# EAGLE design mds2 (EAGLE 7.3.0)
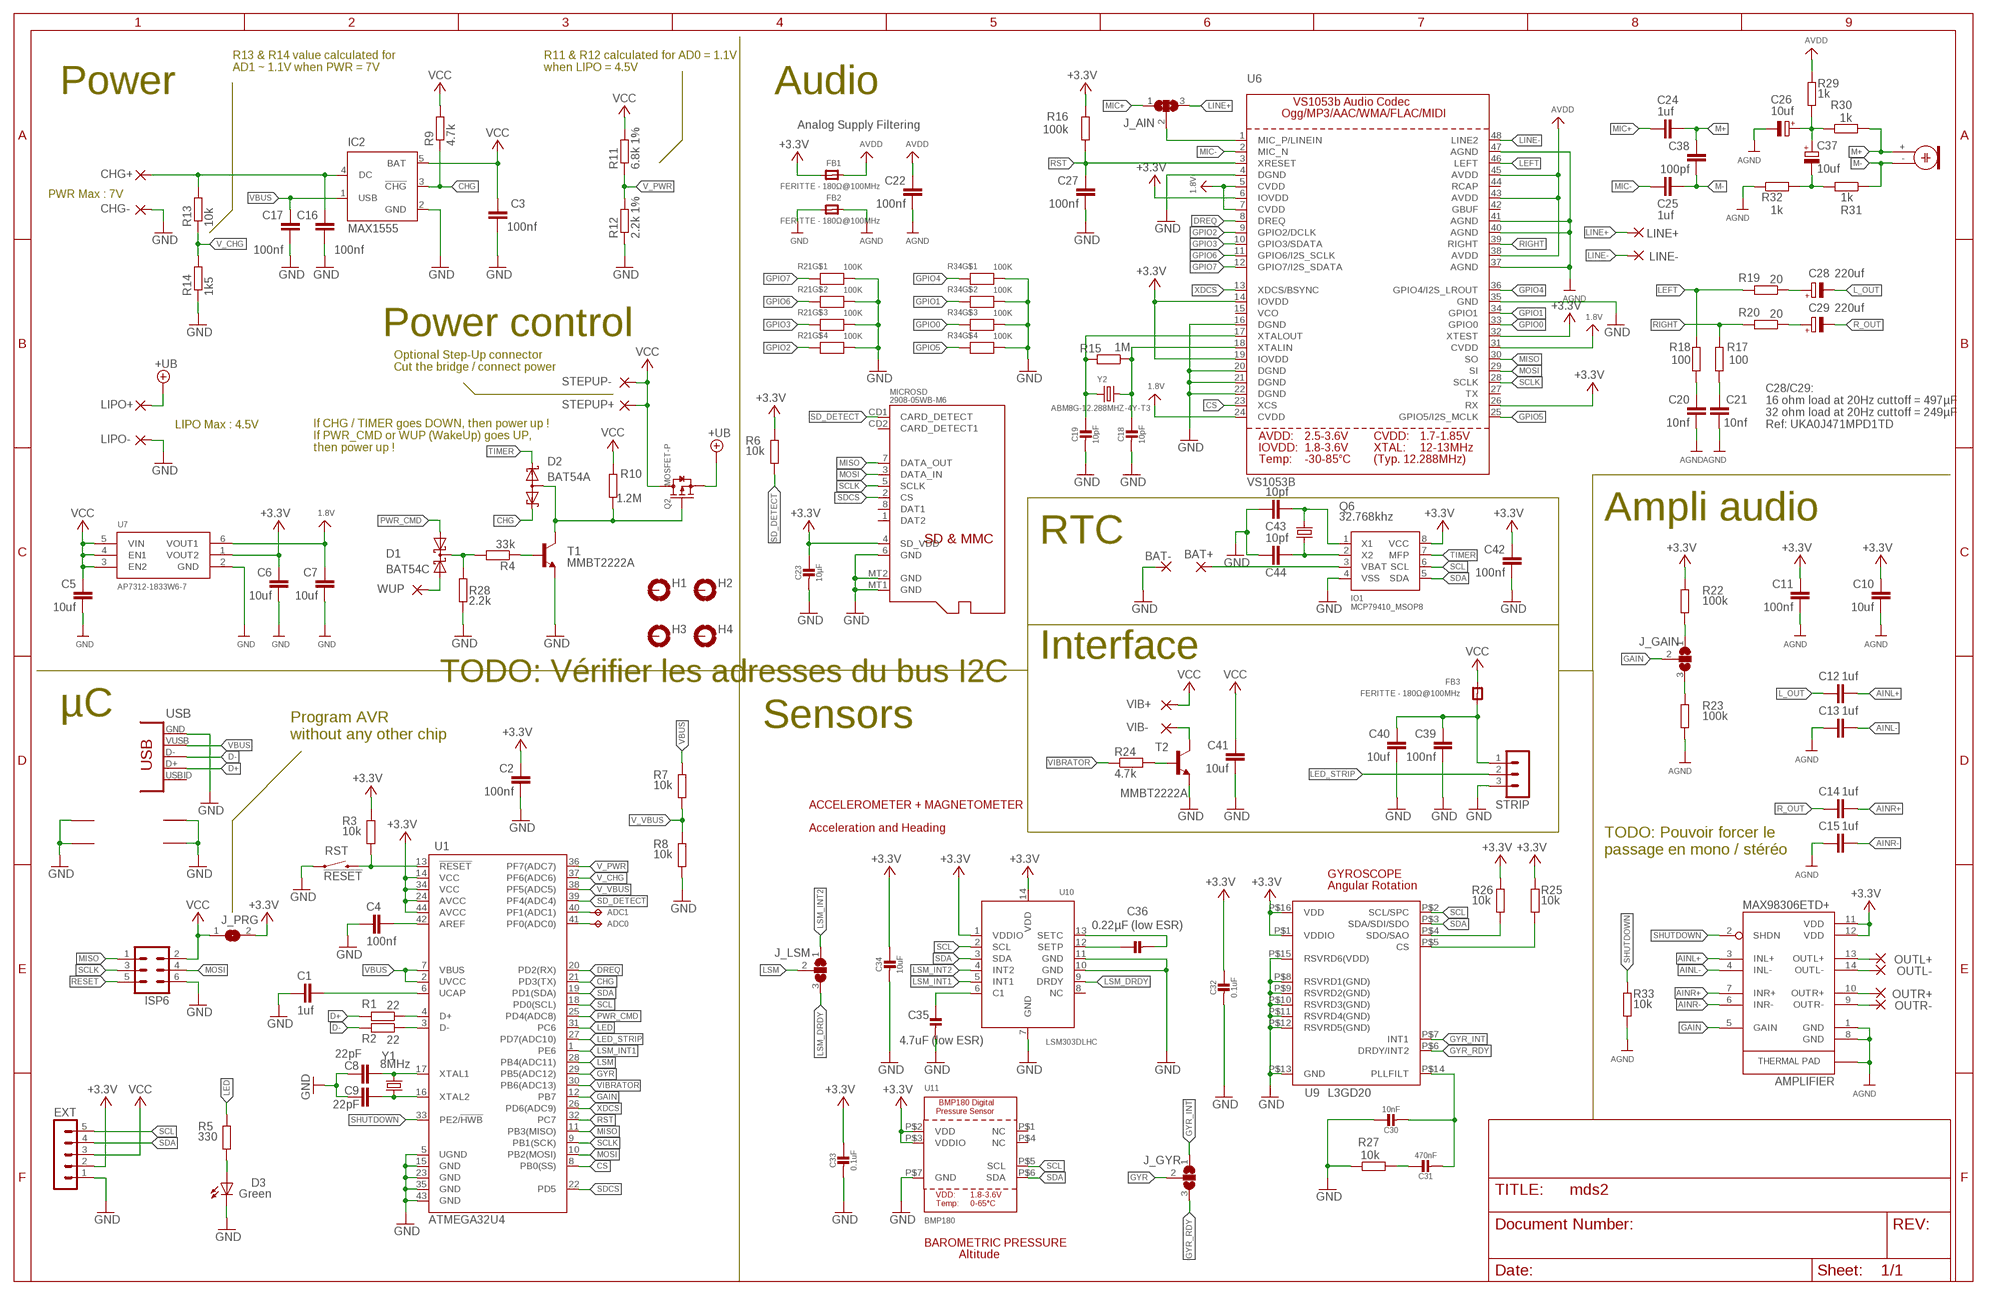
[diagram p0: schematic, sheet 1]

## Parts
ADC0  TPB1,27  [B1,27]
ADC1  TPB1,27  [B1,27]
AMPLIFIER  MAX98306ETD+  [14-TDFN]
BAT+  1,6/0,8  [1,6/0,8]
BAT-  1,6/0,8  [1,6/0,8]
C1  1uf  C-EUC0805  [C0805]
C2  100nf  C-EUC0805  [C0805]
C3  100nf  C-EUC0805  [C0805]
C4  100nf  C-EUC0805  [C0805]
C5  10uf  C-EUC0805  [C0805]
C6  10uf  C-EUC0805  [C0805]
C7  10uf  C-EUC0805  [C0805]
C8  22pF  CAP0402-CAP  [0402-CAP]
C9  22pF  CAP0402-CAP  [0402-CAP]
C10  10uf  C-EUC0805  [C0805]
C11  100nf  C-EUC0805  [C0805]
C12  1uf  C-EUC0805  [C0805]
C13  1uf  C-EUC0805  [C0805]
C14  1uf  C-EUC0805  [C0805]
C15  1uf  C-EUC0805  [C0805]
C16  100nf  C-EUC0805  [C0805]
C17  100nf  C-EUC0805  [C0805]
C18  10pF  CAP_CERAMIC_0805MP  [_0805MP]
C19  10pF  CAP_CERAMIC_0805MP  [_0805MP]
C20  10nf  C-EUC0805  [C0805]
C21  10nf  C-EUC0805  [C0805]
C22  100nf  C-EUC0805  [C0805]
C23  10µF  CAP_CERAMIC_0805MP  [_0805MP]
C24  1uf  C-EUC0805  [C0805]
C25  1uf  C-EUC0805  [C0805]
C26  10uf  CPOL-EUC  [PANASONIC_C]
C27  100nf  C-EUC0805  [C0805]
C28  220uf  CPOL-EUD  [PANASONIC_D]
C29  220uf  CPOL-EUD  [PANASONIC_D]
C30  10nF  CAP_CERAMIC_0805MP  [_0805MP]
C31  470nF  CAP_CERAMIC_0805MP  [_0805MP]
C32  0.1uF  CAP_CERAMIC_0805MP  [_0805MP]
C33  0.1uF  CAP_CERAMIC_0805MP  [_0805MP]
C34  10uF  CAP_CERAMIC_0805MP  [_0805MP]
C35  4.7uF (low ESR)  CAP_CERAMIC_0805MP  [_0805MP]
C36  0.22µF (low ESR)  CAP_CERAMIC_0805MP  [_0805MP]
C37  10uf  CPOL-EUC  [PANASONIC_C]
C38  100pf  C-EUC0805  [C0805]
C39  100nf  C-EUC0805  [C0805]
C40  10uf  C-EUC0805  [C0805]
C41  10uf  C-EUC0805  [C0805]
C42  100nf  C-EUC0805  [C0805]
C43  10pf  C-EUC0805  [C0805]
C44  10pf  C-EUC0805  [C0805]
CHG+  2,15/1,0  [2,15/1,0]
CHG-  2,15/1,0  [2,15/1,0]
D1  BAT54C  [SOT23]
D2  BAT54A  [SOT23]
D3  Green  LED0603  [LED-0603]
EXT  MA05-1  [MA05-1]
FB1  FERITTE - 180Ω@100MHz  FERRITE_0805MP  [_0805MP]
FB2  FERITTE - 180Ω@100MHz  FERRITE_0805MP  [_0805MP]
FB3  FERITTE - 180Ω@100MHz  FERRITE_0805MP  [_0805MP]
H1  MOUNT-PAD-ROUND3.0  [3,0-PAD]
H2  MOUNT-PAD-ROUND3.0  [3,0-PAD]
H3  MOUNT-PAD-ROUND3.0  [3,0-PAD]
H4  MOUNT-PAD-ROUND3.0  [3,0-PAD]
IC2  MAX1555  [SOT23-5L]
IO1  MCP79410_MSOP8  [MSOP8]
ISP6  MA03-2  [MA03-2]
J_AIN  SJ2W  [SJ_2]
J_GAIN  SJ2W  [SJ_2]
J_GYR  SJ2W  [SJ_2]
J_LSM  SJ2W  [SJ_2]
J_PRG  SJ  [SJ]
LINE+  1,6/0,8  [1,6/0,8]
LINE-  1,6/0,8  [1,6/0,8]
LIPO+  2,15/1,0  [2,15/1,0]
LIPO-  2,15/1,0  [2,15/1,0]
MIC  ELECTRET_MICROPHON-TOM-1545P-R  [TOM-1545P-R]
MICROSD  2908-05WB-M6  MICROSD  [MICROSD]
OUTL+  2,15/1,0  [2,15/1,0]
OUTL-  2,15/1,0  [2,15/1,0]
OUTR+  2,15/1,0  [2,15/1,0]
OUTR-  2,15/1,0  [2,15/1,0]
Q2  MOSFET-P  MOSFET-P-044021001  [SOT23]
Q6  32.768khz  CRYSTALTC26H  [TC26H]
R1  22  R-EU_M0805  [M0805]
R2  22  R-EU_M0805  [M0805]
R3  10k  R-EU_M0805  [M0805]
R4  33k  R-EU_M0805  [M0805]
R5  330  R-EU_M0805  [M0805]
R6  10k  R-EU_M0805  [M0805]
R7  10k  R-EU_M0805  [M0805]
R8  10k  R-EU_M0805  [M0805]
R9  4.7k  R-EU_M0805  [M0805]
R10  1.2M  R-EU_M0805  [M0805]
R11  6.8k 1%  R-EU_M0805  [M0805]
R12  2.2k 1%  R-EU_M0805  [M0805]
R13  10k  R-EU_M0805  [M0805]
R14  1k5  R-EU_M0805  [M0805]
R15  1M  R-EU_M0805  [M0805]
R16  100k  R-EU_M0805  [M0805]
R17  100  R-EU_M0805  [M0805]
R18  100  R-EU_M0805  [M0805]
R19  20  R-EU_M0805  [M0805]
R20  20  R-EU_M0805  [M0805]
R21  100K  RESISTOR_4PACK  [RESPACK_4X0603]
R22  100k  R-EU_M0805  [M0805]
R23  100k  R-EU_M0805  [M0805]
R24  4.7k  R-EU_M0805  [M0805]
R25  10k  R-EU_M0805  [M0805]
R26  10k  R-EU_M0805  [M0805]
R27  10k  R-EU_M0805  [M0805]
R28  2.2k  R-EU_M0805  [M0805]
R29  1k  R-EU_M0805  [M0805]
R30  1k  R-EU_M0805  [M0805]
R31  1k  R-EU_M0805  [M0805]
R32  1k  R-EU_M0805  [M0805]
R33  10k  R-EU_M0805  [M0805]
R34  100K  RESISTOR_4PACK  [RESPACK_4X0603]
RST  !RESET  SWITCH-MOMENTARY-2SMD  [TACTILE_SWITCH_SMD]
STEPUP+  2,15/1,0  [2,15/1,0]
STEPUP-  2,15/1,0  [2,15/1,0]
STRIP  MA03-1  [MA03-1]
T1  MMBT2222A  MMBT2222ALT1-NPN-SOT23-BEC  [SOT23-BEC]
T2  MMBT2222A  MMBT2222ALT1-NPN-SOT23-BEC  [SOT23-BEC]
U1  ATMEGA32U4  ATMEGA32U4QFN2  [QFN-44-NOPAD]
U6  VS1053B  [LQFP48]
U7  AP7312-1833W6-7  VREG_SOT23-6_DUALAP7312  [SOT23-6]
U9  L3GD20  GYRO_L3G2400D  [L3G4200D_LGA16L]
U10  LSM303DLHC  [LGA14]
U11  BMP180  BMP180EXT  [BMP180_EXTENDED]
USB  CON-USB-F-MICRO-B  [CONN_USB_MICRO-B]
VIB+  1,6/0,8  [1,6/0,8]
VIB-  1,6/0,8  [1,6/0,8]
WUP  1,6/0,8  [1,6/0,8]
Y1  8MHz  CRYSTAL5X3  [CRYSTAL-SMD-5X3]
Y2  ABM8G-12.288MHZ-4Y-T3  CRYSTAL3.2X2.5  [CRYSTAL_3.2X2.5]

## Nets
1.8V: C7.2 U6.5(CVDD) U6.7(CVDD) U6.24(CVDD) U6.31(CVDD) U7.6(VOUT1)
+3V3: AMPLIFIER.11(VDD) AMPLIFIER.12(VDD) C2.2 C6.2 C10.2 C11.2 C23.1 C32.1 C33.1 C34.1 C42.2 EXT.2 FB1.1 IO1.8(VCC) J_PRG.2 MICROSD.4(SD_VDD) R3.1 R6.1 R16.2 R22.2 R25.2 R26.2 U1.14(VCC) U1.24(AVCC) U1.34(VCC) U1.44(AVCC) U6.6(IOVDD) U6.14(IOVDD) U6.19(IOVDD) U6.26(RX) U6.32(XTEST) U7.1(VOUT2) U9.P$1(VDDIO) U9.P$16(VDD) U10.1(VDDIO) U10.14(VDD) U11.P$2(VDD) U11.P$3(VDDIO) ; supply symbol labelled +3.3V
+UB: LIPO+.1(P) Q2.2(S)
AGND: AMPLIFIER.1(GND) AMPLIFIER.8(GND) AMPLIFIER.15(GND) C10.1 C11.1 C13.2 C15.2 C20.1 C21.1 C22.1 C26.- FB2.2 R23.1 R32.1 R33.1 U6.37(AGND) U6.40(AGND) U6.41(AGND) U6.47(AGND)
AINL+: AMPLIFIER.3(INL+) C12.1
AINL-: AMPLIFIER.4(INL-) C13.1
AINR+: AMPLIFIER.7(INR+) C14.1
AINR-: AMPLIFIER.6(INR-) C15.1
AREF: C4.1 U1.42(AREF)
AVDD: C22.2 FB1.2 R29.2 U6.38(AVDD) U6.43(AVDD) U6.45(AVDD)
CHG: D2.2(K2) IC2.3(!CHG) R9.1 U1.21(PD3(TX))
CS: U1.8(PB0(SS)) U6.23(XCS)
D+: R1.2 USB.P3(D+)
D-: R2.2 USB.P2(D-)
DREQ: U1.20(PD2(RX)) U6.8(DREQ)
GAIN: AMPLIFIER.5(GAIN) J_GAIN.2 U1.12(PB7)
GND [power]: BAT-.1(P) C1.2 C2.1 C3.1 C4.2 C5.1 C6.1 C7.1 C8.2 C9.2 C16.1 C17.1 C18.2 C19.2 C23.2 C27.1 C30.1 C32.2 C33.2 C34.2 C35.2 C39.1 C40.1 C41.1 C42.1 C43.2 C44.2 CHG-.1(P) D3.C EXT.1 FB2.1 IC2.2(GND) IO1.4(VSS) ISP6.6 LIPO-.1(P) MICROSD.6(GND) MICROSD.MT1(GND) MICROSD.MT2(GND) R8.2 R12.1 R14.1 R21.5 R21.6 R21.7 R21.8 R27.1 R28.2 R34.5 R34.6 R34.7 R34.8 RST.1 STRIP.3 T1.E T2.E U1.5(UGND) U1.15(GND) U1.23(GND) U1.35(GND) U1.43(GND) U6.4(DGND) U6.16(DGND) U6.20(DGND) U6.21(DGND) U6.22(DGND) U6.35(GND) U7.2(GND) U9.P$8(RSVRD1(GND)) U9.P$9(RSVRD2(GND)) U9.P$10(RSVRD3(GND)) U9.P$11(RSVRD4(GND)) U9.P$12(RSVRD5(GND)) U9.P$13(GND) U9.P$15(RSVRD6(VDD)) U10.7(GND) U10.10(GND) U10.11(GND) U11.P$7(GND) USB.BODY@1(BODY) USB.BODY@2(BODY) USB.BODY@3(BODY) USB.BODY@4(BODY) USB.P5(GND)
GPIO0: R34.3 U6.33(GPIO0)
GPIO1: R34.2 U6.34(GPIO1)
GPIO2: R21.4 U6.9(GPIO2/DCLK)
GPIO3: R21.3 U6.10(GPIO3/SDATA)
GPIO4: R34.1 U6.36(GPIO4/I2S_LROUT)
GPIO5: R34.4 U6.25(GPIO5/I2S_MCLK)
GPIO6: R21.2 U6.11(GPIO6/I2S_SCLK)
GPIO7: R21.1 U6.12(GPIO7/I2S_SDATA)
GYR: J_GYR.2 U1.29(PB5(ADC12))
GYR_INT: J_GYR.1 U9.P$7(INT1)
GYR_RDY: J_GYR.3 U9.P$6(DRDY/INT2)
L_OUT: C12.2 C28.-
LED: R5.1 U1.31(PC6)
LED_STRIP: STRIP.2 U1.27(PD7(ADC10))
LEFT: R17.2 R19.2 U6.46(LEFT)
LEFT_FILTERED: C28.+ R19.1
LINE+: J_AIN.3 LINE+.1(P)
LINE-: LINE-.1(P) U6.48(LINE2)
LSM: J_LSM.2 U1.28(PB4(ADC11))
LSM_DRDY: J_LSM.3 U10.9(DRDY)
LSM_INT1: U1.1(PE6) U10.5(INT1)
LSM_INT2: J_LSM.1 U10.4(INT2)
M+: C24.1 C38.2 MIC.+ R30.2
M-: C25.1 C38.1 MIC.- R31.1
MIC+: C24.2 J_AIN.1
MIC-: C25.2 U6.2(MIC_N)
MISO: ISP6.1 MICROSD.7(DATA_OUT) U1.11(PB3(MISO)) U6.30(SO)
MOSI: ISP6.4 MICROSD.3(DATA_IN) U1.10(PB2(MOSI)) U6.29(SI)
N$1: C9.1 U1.16(XTAL2) Y1.1
N$2: R1.1 U1.4(D+)
N$3: C16.2 CHG+.1(P) IC2.4(DC) R13.2
N$4: C8.1 U1.17(XTAL1) Y1.3
N$5: C1.1 U1.6(UCAP)
N$6 [power]: C39.2 C40.2 FB3.1 STRIP.1
N$7: R2.1 U1.3(D-)
N$8: D3.A R5.2
N$9: R4.1 T1.B
N$10: D2.3(AA) Q2.1(G) R10.1 T1.C
N$11: D1.3(CC) R4.2 R28.1
N$12: D1.2(A2) WUP.1(P)
N$13: R24.2 T2.B
N$14: T2.C VIB-.1(P)
N$15: ADC1.TP U1.40(PF1(ADC1))
N$16: J_AIN.2 U6.1(MIC_P/LINEIN)
N$17: AMPLIFIER.14(OUTL-) OUTL-.1(P)
N$18: J_GAIN.1 R22.1
N$19: AMPLIFIER.13(OUTL+) OUTL+.1(P)
N$20: C37.- R31.2 R32.2
N$21: ADC0.TP U1.41(PF0(ADC0))
N$22: C44.1 IO1.2(X2) Q6.1
N$23: C26.+ C37.+ R29.1 R30.1
N$24: AMPLIFIER.10(OUTR+) OUTR+.1(P)
N$25: AMPLIFIER.9(OUTR-) OUTR-.1(P)
N$26: J_GAIN.3 R23.2
N$27: C43.1 IO1.1(X1) Q6.2
N$29: C19.1 R15.2 U6.17(XTALOUT) Y2.1
N$30: C18.1 R15.1 U6.18(XTALIN) Y2.2
N$31: C20.2 R17.1
N$32: C21.2 R18.1
N$37: BAT+.1(P) IO1.3(VBAT)
N$40: R25.1 U9.P$5(CS)
N$41: R26.1 U9.P$4(SDO/SAO)
N$42: C31.1 R27.2
N$43: C30.2 C31.2 U9.P$14(PLLFILT)
N$44: C35.1 U10.6(C1)
N$45: C36.1 U10.12(SETP)
N$46: C36.2 U10.13(SETC)
PWR_CMD: D1.1(A1) U1.25(PD4(ADC8))
R_OUT: C14.2 C29.-
RESET: ISP6.5 R3.2 RST.3 U1.13(!RESET)
RIGHT: R18.2 R20.2 U6.39(RIGHT)
RIGHT_FILTERED: C29.+ R20.1
RST: C27.2 R16.1 U1.32(PC7) U6.3(XRESET)
SCL: EXT.5 IO1.6(SCL) U1.18(PD0(SCL)) U9.P$2(SCL/SPC) U10.2(SCL) U11.P$5(SCL)
SCLK: ISP6.3 MICROSD.5(SCLK) U1.9(PB1(SCK)) U6.28(SCLK)
SD_DETECT: MICROSD.CD1(CARD_DETECT) R6.2 U1.39(PF4(ADC4))
SDA: EXT.4 IO1.5(SDA) U1.19(PD1(SDA)) U9.P$3(SDA/SDI/SDO) U10.3(SDA) U11.P$6(SDA)
SDCS: MICROSD.2(CS) U1.22(PD5)
SHUTDOWN: AMPLIFIER.2(SHDN) R33.2 U1.33(PE2/!HWB)
TIMER: D2.1(K1) IO1.7(MFP)
V_CHG: R13.1 R14.2 U1.37(PF6(ADC6))
V_PWR: R11.1 R12.2 U1.36(PF7(ADC7))
V_VBUS: R7.2 R8.1 U1.38(PF5(ADC5))
VBUS [power]: C17.2 IC2.1(USB) R7.1 U1.2(UVCC) U1.7(VBUS) USB.P1(VUSB)
VCC [power]: C3.2 C5.2 C41.2 EXT.3 FB3.2 IC2.5(BAT) ISP6.2 J_PRG.1 Q2.3(D) R9.2 R10.2 R11.2 STEPUP+.1(P) STEPUP-.1(P) U7.3(EN2) U7.4(EN1) U7.5(VIN) VIB+.1(P)
VIBRATOR: R24.1 U1.30(PB6(ADC13))
XDCS: U1.26(PD6(ADC9)) U6.13(XDCS/BSYNC)
Unconnected: H1.B3,0(MOUNT) H2.B3,0(MOUNT) H3.B3,0(MOUNT) H4.B3,0(MOUNT) MICROSD.1(DAT2) MICROSD.8(DAT1) MICROSD.CD2(CARD_DETECT1) U6.15(VCO) U6.27(TX) U6.42(GBUF) U6.44(RCAP) U10.8(NC) U11.P$1(NC) U11.P$4(NC) USB.P4(USBID)

## Notes on the sheet
- R13 & R14 value calculated for
  AD1 ~ 1.1V when PWR = 7V
- R11 & R12 calculated for AD0 = 1.1V
  when LIPO = 4.5V
- Power | Audio
- Analog Supply Filtering
- PWR Max : 7V
- Power control
- Optional Step-Up connector
  Cut the bridge / connect power
- LIPO Max : 4.5V
- C28/C29:
  16 ohm load at 20Hz cuttoff = 497µF
  32 ohm load at 20Hz cuttoff = 249µF
  Ref: UKA0J471MPD1TD
- If CHG / TIMER goes DOWN, then power up !
  If PWR_CMD or WUP (WakeUp) goes UP,
  then power up !
- Ampli audio
- RTC
- Interface
- TODO: Vérifier les adresses du bus I2C
- µC | Sensors
- Program AVR
  without any other chip
- ACCELEROMETER + MAGNETOMETER
- Acceleration and Heading
- TODO: Pouvoir forcer le
  passage en mono / stéréo
- GYROSCOPE
- Angular Rotation
- BAROMETRIC PRESSURE
- Altitude

## Library data of the parts
ADC0 ADC1 = testpad:TP: Test pad
AMPLIFIER = SparkFun-PowerIC:MAX98306: Stereo 3.7W Class D Amplifier Datasheet: http://datasheets.maxim-ic.com/en/ds/MAX98306.pdf The MAX98306 stereo 3.7W Class D amplifier provides Class AB audio performance with Class D efficiency. This device offers five selectable gain settings (6dB, 9dB, 12dB, 15dB, and 18dB) set by a single gain-select input (GAIN). Active emissions limiting, edge-rate, and overshoot control circuitry combined with a filterless spread-spectrum modulation scheme (SSM) provide excellent EMI performance while eliminating the need for output filtering found in traditional Class D devices. These features reduce application component count. The IC's 2.0mA quiescent current with a 3.7V supply extends battery life in portable applications. The IC is available in a 14-pin TDFN (3mm x 3mm x 0.75mm) package specified over the extended -40NC to +85NC temperature range.
BAT+ BAT- LINE+ LINE- VIB+ VIB- WUP = wirepad:1,6/0,8: THROUGH-HOLE PAD
C1-C7 C10-C17 C20-C22 C24 C25 C27 C38-C44 = rcl:C-EU: CAPACITOR, European symbol
C8 C9 = SparkFun:CAP: Capacitor Standard 0603 ceramic capacitor, and 0.1" leaded capacitor.
C18 C19 C23 C30-C36 = microbuilder:CAP_CERAMIC: Ceramic Capacitors For new designs, use the packages preceded by an '_' character since they are more reliable: The following footprints should be used on most boards: _0402 - Standard footprint for regular board layouts _0603 - Standard footprint for regular board layouts _0805 - Standard footprint for regular board layouts _1206 - Standard footprint for regular board layouts For extremely tight-pitch boards where space is at a premium, the following 'micro-pitch' footprints can be used (smaller pads, no silkscreen outline, etc.): _0402MP - Micro-pitch footprint for very dense/compact boards _0603MP - Micro-pitch footprint for very dense/compact boards _0805MP - Micro-pitch footprint for very dense/compact boards _1206MP - Micro-pitch footprint for very dense/compact boards
C26 C28 C29 C37 = rcl:CPOL-EU: POLARIZED CAPACITOR, European symbol
CHG+ CHG- LIPO+ LIPO- OUTL+ OUTL- OUTR+ OUTR- STEPUP+ STEPUP- = wirepad:2,15/1,0: THROUGH-HOLE PAD
D1 = diode:BAT54C: Schottky Diodes Source: Fairchild .. BAT54.pdf
D2 = diode:BAT54A: Schottky Diodes Source: Fairchild .. BAT54.pdf
D3 = SparkFun:LED: LEDs Standard schematic elements and footprints for 5mm, 3mm, 1206, and 0603 sized LEDs. 5mm - Spark Fun Electronics SKU : COM-00529 (and others)
EXT = con-lstb:MA05-1: PIN HEADER; OC_FARNELL: unknown; OC_NEWARK: unknown
FB1-FB3 = microbuilder:FERRITE: Ferrite Bead 0603 MMZ1608B121C - 120 Ohm @ 100MHz, 600mA, 0.15 Ohm DC Resistance - Digikey: 445-2164-1-ND BK1608HW121-T - 120 Ohm, 600mA Ferrite Chip - Digikey: 587-1876-2-ND 0805 HZ0805B272R-10 - 2.7K Ohm @ 100MHz, 200mA, 0.8 Ohm DC Resistance - Digikey: 240-2504-1-ND (see also Murata BLM21BD272SN1L) MMZ2012Y152B - 1.5K Ohm @ 100MHz, 500mA, 0.4 Ohm DC Resistance - Digikey: 445-1560-1-ND - Mainly for high frequency (80-400MHz) MMZ2012R102A - 1K Ohm @ 100MHz, 500mA, 0.3 Ohm DC Resistance - Digikey: 445-1555-2-ND - More general purpose (10-200MHz)
H1-H4 = holes:MOUNT-PAD-ROUND: MOUNTING PAD, round
IC2 = maxim:MAX1555: Dual-Input USB/AC Adapter 1-Cell Li+ Battery Chargers Source: http://www.maxim-ic.com .. MAX1551-MAX1555.pdf; MF: MAXIM; MPN: MAX1555EZK+T; OC_FARNELL: 1628222; OC_NEWARK: 59J2761
IO1 = timers-clocks:MCP79410_MSOP8: I2C Real-Time Clock/Calendar with EEPROM, SRAM, Unique ID and Battery Switchover, MPC79410 Features: • Real-Time Clock/Calendar (RTCC), Battery Backed: - Hours, Minutes, Seconds, Day of Week, Day, Month, Year and Leap Year - Dual alarm with single output • On-Chip Digital Trimming/Calibration: - Range -127 to +127 ppm - Resolution 1 ppm • Programmable Open-Drain Output Control: - CLKOUT with 4 selectable frequencies - Alarm output • 64 Bytes SRAM, Battery Backed • 1 Kbits EEPROM (128x8) - 8 bytes/page - Block/sector write protection - Protect none, 1/4, 1/2 or all of array • Separate 64-Bit Unique ID: - User or factory programmable - Protected area - EUI-48™ or EUI-64™ MAC address - Custom ID programming • Automatic VCC Switchover to VBAT Backup Supply • Power-Fail Time-Stamp for Battery Switchover • Low-Power CMOS Technology: - Dynamic Current: 400 A max read - Dynamic Current: 3mA max EEPROM write - Battery Backup Current: <700nA @ 1.8V • I2C 100 kHz and 400 kHz Compatibility • ESD Protection >4,000V • More than 1 Million Erase/Write Cycles • Packages include 8-Lead SOIC, TSSOP, 2x3 TDFN, MSOP • Pb-Free and RoHS Compliant • Temperature Ranges: - Industrial (I): -40°C to +85°C. Description: The MCP7941X series of low-power Real-Time Clocks (RTC) uses digital timing compensation for an accurate clock/calendar, a programmable output control for versatility, a power sense circuit that automatically switches to the backup supply, and nonvolatile memory for data storage. Using a low-cost 32.768 kHz crystal, it tracks time using several internal registers. For communication, the MCP7941X uses the I2C™ bus. The clock/calendar automatically adjusts for months with fewer than 31 days, including corrections for leap years. The clock operates in either the 24-hour or 12-hour format with an AM/PM indicator and settable alarm(s) to the second, minute, hour, day of the week, date or month. Using the programmable CLKOUT, frequencies of 32.768, 8.192 and 4.096 kHz and 1 Hz can be generated from the external crystal. Along with the on-board Serial EEPROM and batterybacked SRAM memory, a 64-bit protected space is available for a unique ID or MAC address to be programmed at the factory or by the end user. The device is fully accessible through the serial interface while VCC is between 1.8V and 5.5V, but can operate down to 1.3V for timekeeping and SRAM retention only. The RTC series of devices are available in the standard 8-lead SOIC, TSSOP, MSOP and 2x3 TDFN packages.; MPN: MCP79410-I/MS; OC_FARNELL: 1823153; PACKAGE: MSOP8; SUPPLIER: MICROCHIP
ISP6 = con-lstb:MA03-2: PIN HEADER; OC_FARNELL: unknown; OC_NEWARK: unknown
J_AIN J_GAIN J_GYR J_LSM = jumper:SJ2W: SMD solder JUMPER
J_PRG = jumper:SJ: SMD solder JUMPER
MIC = microphon:ELECTRET_MICROPHON-: Electret Condenser Microphone
MICROSD = microbuilder:MICROSD: MicroSD/Transflash Card Holder with SPI pinout 3M: 2908-05WB-MG 4UConnector: 19656 Footprint courtesy: Adafruit Industries
Q2 = OPL Eagle Library:MOSFET-P: CJ2305：SMD MOSFET P-CH 8V-4.1A
Q6 = crystal:CRYSTAL: CRYSTAL; OC_FARNELL: unknown; OC_NEWARK: unknown
R1-R20 R22-R33 = rcl:R-EU_: RESISTOR, European symbol
R21 R34 = microbuilder:RESISTOR_4PACK: Resistor Packs (4 resistors) 4 x 0603 10K 1/16W - Digikey: YC164J-10KCT-ND
RST = SparkFun-Electromechanical:SWITCH-MOMENTARY-2: Various NO switches- pushbuttons, reed, etc; PROD_ID: SWCH-08247
STRIP = con-lstb:MA03-1: PIN HEADER; OC_FARNELL: unknown; OC_NEWARK: unknown
T1 T2 = transistor-neu-to92:*-NPN-: NPN Transistror
U1 = SparkFun:ATMEGA32U4
U6 = microbuilder:VS1053B: VS1053b Audio Codec - Ogg Vorbis/MP3/AAC/WMA/FLAC/MIDI
U7 = microbuilder:VREG_SOT23-6_DUAL: Dual Output SOT23-6 Linear Regulators Diodes Inc. AP7312 - Dual 150mA LDO Linear Regulator 0.2V dropout, 150mA output, 2-6V Input AP7312-1833W6-7 - 1.8V/3.3V SOT23-6 (Digikey: AP7312-1833W6-7DICT-ND) MIC5320 - Dual 150mA ULDO Linear Regulator Ultra-low 35mV dropout at 150mA, 2.3-5.5V Input 3.3V/1.8V SOT23-6 (Digikey: 576-1658-1-ND) 3.3V/1.5V SOT23-6 (Digikey: 576-3483-1-ND)
U9 = microbuilder:GYRO_L3G2400D: L3G4200D - 3-Axis MEMS gyroscope/motion sensor Note: Same footprint works for the newer L3DG20 gyroscope Three selectable scales: 250/500/2000 dps 1²C/SPI Interface 16-bit data 8-bit temperature VDD: 2.4-3.6V (IO 1.8V compatible) -40°C-85°C
U10 = microbuilder:LSM303DLHC: LSM303DLHC 3-Axis I2C Accelerometer and 3-Axis Magnetometer VDD: 2.2-3.6V VDDIO: 1.8-VDD Magnetic Range: +/-1.3 to +/-8.1 gauss Accel Range: +/-2/4/8/16 g Temp: -40 - 85°C
U11 = microbuilder:BMP180: BMP180 Digital Pressure Sensor 1.8-3.6V Supply, I2C Interface
USB = dp_devices:CON-USB-F: USB Female connector
Y1 = SparkFun:CRYSTAL: Crystals
Y2 = microbuilder:CRYSTAL: Crystals

## Net classes
1 power: width 0.254 mm, clearance 0.203 mm

## Board
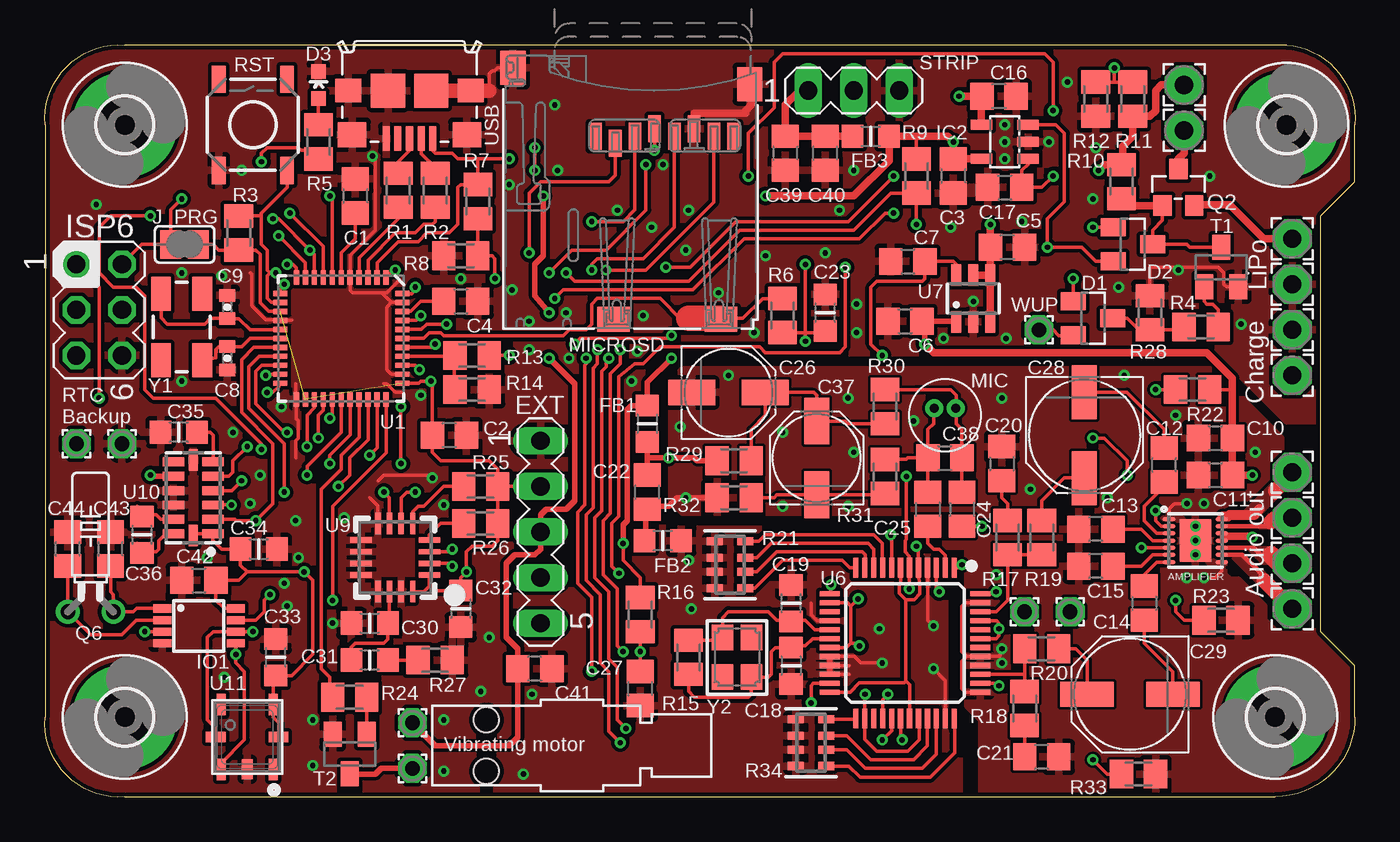
[diagram p1: board, top side]
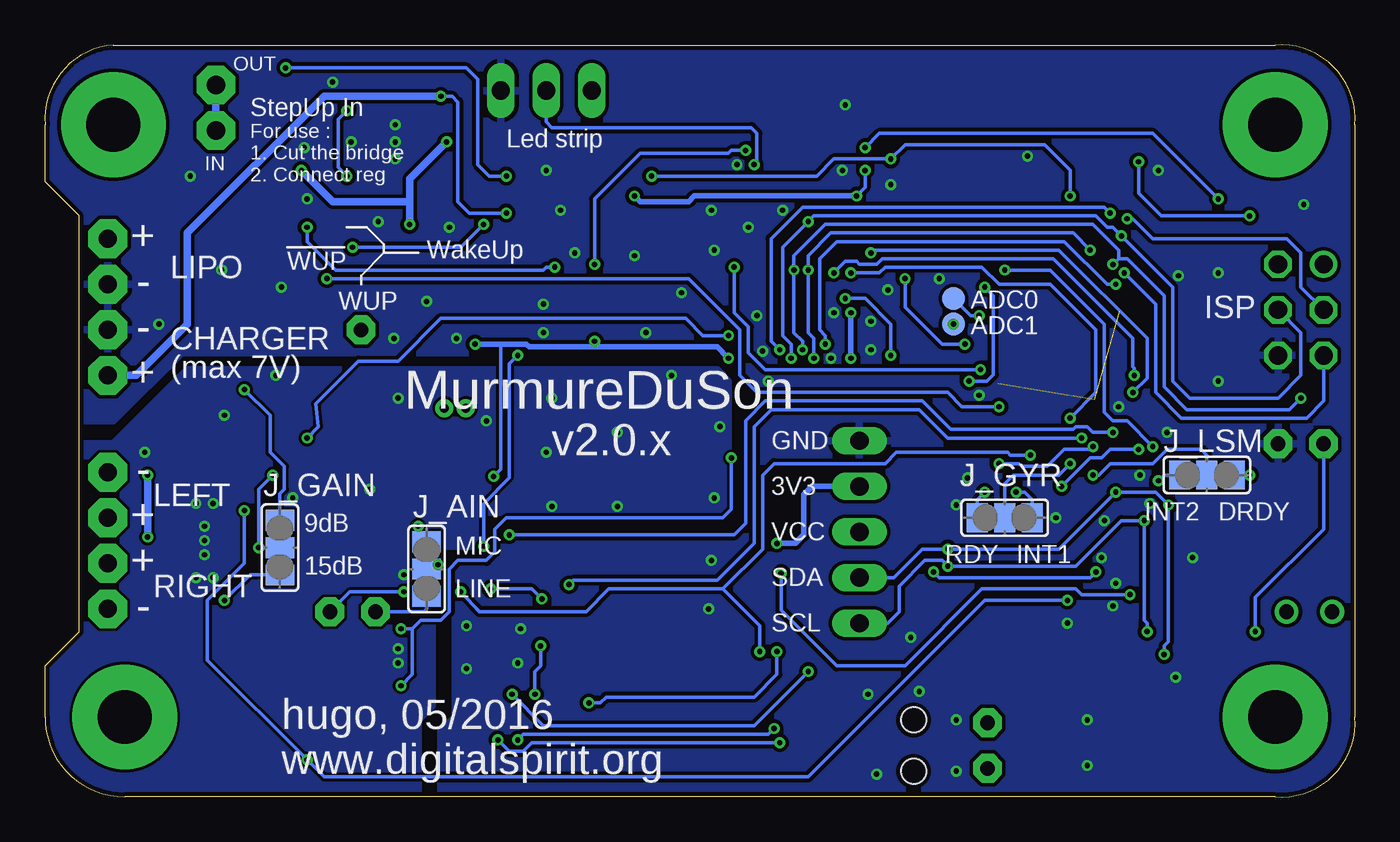
[diagram p2: board, bottom side, seen from below]

Size 73.05 x 41.93 mm. Coordinates in mm from the lower left corner, seen from the top.
Outline: 73.02,4.46 73.04,7.31 71.13,9.22 71.13,32.4 73.02,34.29 73.02,37.49
Outline: 73.04,4.46 arc-90 68.59,0.01 4.46,0.01 arc-99 0.01,4.46 0.01,37.48 arc-99 4.46,41.92 69.23,41.92 arc-90 73.04,37.48
Copper layers (1*16): Top 0.035mm / dielectric 1.5mm / Bottom 0.035mm
Design rules "SeeedStudio_2layer_DRU_no_angle_20140221": minimum track width 6mil, minimum drill 12mil, track to track 6mil, track to pad 6mil, pad to pad 6mil, via to via 6mil, smd to smd 0mil, copper to edge 10mil, drill to drill 10mil, minimum pad ring 10mil, minimum via ring 6mil, stop-mask expansion 2mil, vias tented up to drill 100mil, thermal gap 10mil
Holes 1.4 mm at 24.62,1.44 24.62,4.3

### Footprints (pad centres in the part's own frame; a part is rotated, then mirrored left to right if it is on the bottom)
B1,27 = smd 1.27 x 1.27: TP 0,0
14-TDFN = smd 0.7 x 0.25: 1 -1.475,1.2; 2 -1.475,0.8; 3 -1.475,0.4; 4 -1.475,0; 5 -1.475,-0.4; 6 -1.475,-0.8; 7 -1.475,-1.2; 8 1.475,-1.2; 9 1.475,-0.8; 10 1.475,-0.4; 11 1.475,0; 12 1.475,0.4; 13 1.475,0.8; 14 1.475,1.2 | smd 1.78 x 2.35: 15 0,0
1,6/0,8 = drill 0.813 pad 1.6 octagon: 1 0,0
C0805 = smd 1.3 x 1.5: 1 -0.95,0; 2 0.95,0
0402-CAP = smd 0.7 x 0.9: 1 -0.65,0; 2 0.65,0
_0805MP = smd 1.2 x 1.3: 1 -1.016,0; 2 1.016,0
PANASONIC_C = smd 2.6 x 1.4: + 2.05,0; - -2.05,0
PANASONIC_D = smd 3 x 1.4: + 2.4,0; - -2.4,0
2,15/1,0 = drill 1.016 pad 2.159 octagon: 1 0,0
SOT23 = smd 1 x 1.4: 1 -0.95,-1.1; 2 0.95,-1.1; 3 0,1.1
LED-0603 = smd 0.8 x 0.8: A 0,-0.75; C 0,0.75
MA05-1 = drill 1.016 long: 1 -5.08,0; 2 -2.54,0; 3 0,0; 4 2.54,0; 5 5.08,0
3,0-PAD = drill 3 pad 5.842: B3,0 0,0
SOT23-5L = smd 0.55 x 1.2: 1 -0.95,-1.3; 2 0,-1.3; 3 0.95,-1.3; 4 0.95,1.3; 5 -0.95,1.3
MSOP8 = smd 0.45 x 1: 1 -0.975,-2.05; 2 -0.325,-2.05; 3 0.325,-2.05; 4 0.975,-2.05; 5 0.975,2.05; 6 0.325,2.05; 7 -0.325,2.05; 8 -0.975,2.05
MA03-2 = drill 1.016: 1 -2.54,-1.27 | drill 1.016 octagon: 2 -2.54,1.27; 3 0,-1.27; 4 0,1.27; 5 2.54,-1.27; 6 2.54,1.27
SJ_2 = smd 1.168 x 1.6: 1 -1.524,0; 2 0,0; 3 1.524,0
SJ = smd 1.168 x 1.6: 1 -0.762,0; 2 0.762,0
TOM-1545P-R = drill 0.5 pad 0.8: + 0.6,0.4; - -0.6,0.4
MICROSD = smd 0.7 x 1.5: 1 9,-10.64; 2 7.9,-10.24; 3 6.8,-10.64; 4 5.7,-11.04; 5 4.6,-10.64; 6 3.5,-11.04; 7 2.4,-10.64; 8 1.3,-10.64 | smd 1.8 x 1.4: CD1 2,-0.44; CD2 8,-0.44 | smd 1.4 x 1.9: MT1 0.4,-13.54; MT2 13.6,-14.44
SOT23' = smd 1.016 x 1.143: 1 -0.889,-1.016; 2 0.889,-1.016; 3 0,1.016
TC26H = drill 0.813: 1 -1.27,0; 2 1.27,0
M0805 = smd 1.3 x 1.6: 1 -0.95,0; 2 0.95,0
RESPACK_4X0603 = smd 0.45 x 0.9: 1 -1.3,-0.85; 2 -0.4,-0.85; 3 0.4,-0.85; 4 1.3,-0.85; 5 1.3,0.85; 6 0.4,0.85; 7 -0.4,0.85; 8 -1.3,0.85
TACTILE_SWITCH_SMD = smd 1.524 x 0.762: 1 -2.54,1.905; 2 2.54,1.905; 3 -2.54,-1.905; 4 2.54,-1.905
MA03-1 = drill 1.016 long: 1 -2.54,0; 2 0,0; 3 2.54,0
SOT23-BEC = smd 1 x 1.4: B -0.95,-1.1; C 0,1.1; E 0.95,-1.1
QFN-44-NOPAD = smd 0.8 x 0.3: 1 -3.4,2.5; 2 -3.4,2; 3 -3.4,1.5; 4 -3.4,1; 5 -3.4,0.5; 6 -3.4,0; 7 -3.4,-0.5; 8 -3.4,-1; 9 -3.4,-1.5; 10 -3.4,-2; 11 -3.4,-2.5; 23 3.4,-2.5; 24 3.4,-2; 25 3.4,-1.5; 26 3.4,-1; 27 3.4,-0.5; 28 3.4,0; 29 3.4,0.5; 30 3.4,1; 31 3.4,1.5; 32 3.4,2; 33 3.4,2.5 | smd 0.3 x 0.8: 12 -2.5,-3.4; 13 -2,-3.4; 14 -1.5,-3.4; 15 -1,-3.4; 16 -0.5,-3.4; 17 0,-3.4; 18 0.5,-3.4; 19 1,-3.4; 20 1.5,-3.4; 21 2,-3.4; 22 2.5,-3.4; 34 2.5,3.4; 35 2,3.4; 36 1.5,3.4; 37 1,3.4; 38 0.5,3.4; 39 0,3.4; 40 -0.5,3.4; 41 -1,3.4; 42 -1.5,3.4; 43 -2,3.4; 44 -2.5,3.4
LQFP48 = smd 1.1 x 0.285: 1 -4.2,2.75; 2 -4.2,2.25; 3 -4.2,1.75; 4 -4.2,1.25; 5 -4.2,0.75; 6 -4.2,0.25; 7 -4.2,-0.25; 8 -4.2,-0.75; 9 -4.2,-1.25; 10 -4.2,-1.75; 11 -4.2,-2.25; 12 -4.2,-2.75; 25 4.2,-2.75; 26 4.2,-2.25; 27 4.2,-1.75; 28 4.2,-1.25; 29 4.2,-0.75; 30 4.2,-0.25; 31 4.2,0.25; 32 4.2,0.75; 33 4.2,1.25; 34 4.2,1.75; 35 4.2,2.25; 36 4.2,2.75 | smd 0.285 x 1.1: 13 -2.75,-4.2; 14 -2.25,-4.2; 15 -1.75,-4.2; 16 -1.25,-4.2; 17 -0.75,-4.2; 18 -0.25,-4.2; 19 0.25,-4.2; 20 0.75,-4.2; 21 1.25,-4.2; 22 1.75,-4.2; 23 2.25,-4.2; 24 2.75,-4.2; 37 2.75,4.2; 38 2.25,4.2; 39 1.75,4.2; 40 1.25,4.2; 41 0.75,4.2; 42 0.25,4.2; 43 -0.25,4.2; 44 -0.75,4.2; 45 -1.25,4.2; 46 -1.75,4.2; 47 -2.25,4.2 | smd 0.28 x 1.1: 48 -2.75,4.2
SOT23-6 = smd 0.55 x 1.2: 1 -0.95,-1.3; 2 0,-1.3; 3 0.95,-1.3; 4 0.95,1.3; 5 0,1.3; 6 -0.95,1.3
L3G4200D_LGA16L = smd 1.2 x 0.3: P$1 -1.9,0.975; P$2 -1.9,0.325; P$3 -1.9,-0.325; P$4 -1.9,-0.975; P$9 1.9,-0.975; P$10 1.9,-0.325; P$11 1.9,0.325; P$12 1.9,0.975 | smd 0.3 x 1.2: P$5 -0.975,-1.9; P$6 -0.325,-1.9; P$7 0.325,-1.9; P$8 0.975,-1.9; P$13 0.975,1.9; P$14 0.325,1.9; P$15 -0.325,1.9; P$16 -0.975,1.9
LGA14 = smd 0.5 x 1.2: 1 2,1.1; 2 1.2,1.1; 3 0.4,1.1; 4 -0.4,1.1; 5 -1.2,1.1; 6 -2,1.1; 8 -2,-1.1; 9 -1.2,-1.1; 10 -0.4,-1.1; 11 0.4,-1.1; 12 1.2,-1.1; 13 2,-1.1 | smd 1.2 x 0.5: 7 -2.1,0; 14 2.1,0
BMP180_EXTENDED = smd 1.2 x 0.5: P$1 -1.8,-1.45; P$3 1.8,-1.45; P$4 1.8,1.45; P$6 -1.8,1.45 | smd 0.6 x 1.1: P$2 0,-1.75; P$5 0,1.75 | smd 1.1 x 0.6: P$7 -1.8,0
CONN_USB_MICRO-B = smd 1.6 x 1.4: BODY@1 -3.2,2.45; BODY@2 3.2,2.45 | smd 1.45 x 1.3: BODY@3 3.425,0; BODY@6 -3.425,0 | smd 1.9 x 1.9: BODY@4 1.2,0; BODY@5 -1.2,0 | smd 0.4 x 1.35: P1 -1.3,2.675; P2 -0.65,2.675; P3 0,2.675; P4 0.65,2.675; P5 1.3,2.675
CRYSTAL-SMD-5X3 = smd 1.9 x 1.1: 1 -1.85,-1.15; 2 1.85,-1.15; 3 1.85,1.15; 4 -1.85,1.15
CRYSTAL_3.2X2.5 = smd 1.4 x 1.2: 1 -1.1,-0.8; 2 1.1,0.8; GND1 -1.1,0.8; GND2 1.1,-0.8

### Placement (x,y rotation side)
ADC0  22.4,27.79 0 bottom
ADC1  22.4,26.36 0 bottom
AMPLIFIER  64.15,14.3 0 top
BAT+  1.76,19.7 0 top
BAT-  4.3,19.7 0 top
C1  17.32,33.51 90 top
C2  22.55,20.17 180 top
C3  50.65,34.62 90 top
C4  23.19,27.63 0 top
C5  53.67,30.65 180 top
C6  47.95,26.52 0 top
C7  48.11,29.86 0 top
C8  10.17,24.46 270 top
C9  10.17,27.32 90 top
C10  65.26,20.01 0 top
C11  65.26,17.95 0 top
C12  62.4,18.51 90 top
C13  58.59,14.93 180 top
C14  61.29,10.81 270 top
C15  58.59,12.87 180 top
C16  53.19,39.06 180 top
C17  53.51,33.98 0 top
C18  41.6,7.31 270 top
C19  41.6,10.81 90 top
C20  53.35,18.59 270 top
C21  55.57,2.23 180 top
C22  33.59,17 90 top
C23  43.51,27 90 top
C24  51.13,16.05 270 top
C25  49.22,16.05 270 top
C26  38.11,22.55 0 top
C27  33.19,6.04 90 top
C28  57.96,20.17 270 top
C29  60.5,5.73 180 top
C30  18.11,9.7 0 top
C31  18.11,7.63 180 top
C32  23.19,10.49 270 top
C33  12.87,7.79 90 top
C34  11.92,13.82 0 top
C35  7.47,20.33 180 top
C36  5.41,14.62 270 top
C37  43.03,18.9 90 top
C38  50.18,18.9 0 top
C39  41.29,35.89 90 top
C40  43.51,35.89 90 top
C41  27.32,7.16 180 top
C42  8.58,12.08 0 top
C43  3.66,13.82 90 top
C44  1.28,13.82 90 top
CHG+  69.54,23.51 0 top
CHG-  69.54,26.05 0 top
D1  58.43,26.68 270 top
D2  60.65,30.81 270 top
D3  15.25,39.7 0 top
EXT  27.63,14.78 270 top
FB1  33.59,20.81 270 top
FB2  34.45,14.28 180 top
FB3  46.05,36.84 0 top
H1  4.46,37.48 0 top
H2  4.46,4.46 0 top
H3  69.23,37.48 0 top
H4  68.59,4.46 0 top
IC2  53.51,36.52 90 top
IO1  8.58,9.54 270 top
ISP6  3.03,27.16 270 top
J_AIN  51.76,12.71 270 bottom
J_GAIN  59.94,13.9 270 bottom
J_GYR  19.54,15.57 180 bottom
J_LSM  8.27,17.95 0 bottom
J_PRG  7.79,30.81 0 top
LINE+  54.62,10.33 0 top
LINE-  57.16,10.33 0 top
LIPO+  69.54,31.13 0 top
LIPO-  69.54,28.59 0 top
MIC  50.18,21.28 0 top
MICROSD  39.7,26.21 180 top
OUTL+  69.54,15.57 0 top
OUTL-  69.54,18.11 0 top
OUTR+  69.54,13.03 0 top
OUTR-  69.54,10.49 0 top
Q2  MOSFET-P  [SOT23']  63.19,33.98 0 top
Q6  2.55,10.33 0 top
R1  19.7,33.83 90 top
R2  21.76,33.83 90 top
R3  10.81,31.44 90 top
R4  64.46,26.21 180 top
R5  15.25,36.52 90 top
R6  41.13,26.84 90 top
R7  24.14,33.19 270 top
R8  23.19,30.17 180 top
R9  48.59,34.62 90 top
R10  60.02,34.3 90 top
R11  60.65,38.91 270 top
R12  58.59,38.91 90 top
R13  23.82,24.62 0 top
R14  23.82,22.71 180 top
R15  35.89,7.79 90 top
R16  33.19,10.17 90 top
R17  53.67,14.46 270 top
R18  54.62,4.93 90 top
R19  55.57,14.46 270 top
R20  55.57,8.27 180 top
R21  38.19,12.95 90 top
R22  63.99,22.71 0 top
R23  65.58,9.85 180 top
R24  17,5.57 0 top
R25  24.3,17.32 0 top
R26  24.3,15.25 0 top
R27  21.76,7.63 180 top
R28  61.61,27 90 top
R29  38.43,18.74 180 top
R30  46.84,21.76 90 top
R31  46.84,17.87 270 top
R32  38.43,16.68 0 top
R33  60.97,1.28 180 top
R34  42.72,3.03 90 top
RST  11.6,37.48 90 top
STEPUP+  63.51,37.16 0 top
STEPUP-  63.51,39.7 0 top
STRIP  45.1,39.38 0 top
T1  65.58,29.54 0 top
T2  17,2.39 180 top
U1  16.52,25.57 270 top
U6  47.95,8.58 270 top
U7  51.76,27.79 0 top
U9  19.54,13.35 180 top
U10  8.27,16.68 270 top
U11  11.28,3.35 90 top
USB  20.33,39.38 180 top
VIB+  20.49,4.14 90 top
VIB-  20.49,1.6 90 top
WUP  55.42,26.05 0 top
Y1  7.63,26.21 270 top
Y2  38.59,7.79 270 top

### Tracks (layer width: path | path; a pad name or v marks a point on that pad's centre or on a via)
1.8V  (via drill 0.3 pad 0.61)
  Top 0.203: U6.7 47.7,11.91 47.64,11.84 47.64,11.36 48.01,10.99 | U6.31 48.2,6.27 48.01,6.47 | U6.24 44.89,5.83 45.41,6.36 47.9,6.36 48.01,6.47 | 48.01,6.47 48.01,10.99 | v48.59,13.98 48.7,13.87 U6.5 48.75,11.92 48.78,11.88 48.78,11.32 48.46,10.99 48.01,10.99 | U7.6 50.81,28.94 50.81,29.7 50.65,29.86 C7.2 49.07,29.7 49.07,28.9 48.91,28.75 46.37,28.75 46.05,28.43 46.05,25.25 v46.68,24.62
  Bottom 0.203: v48.59,13.98 48.59,16.36 47.16,17.79 47.16,24.14 v46.68,24.62
+3V3  (via drill 0.3 pad 0.61)  (2 unrouted)
  Top 0.203: U1.14 12.48,27.07 12,27.55 12,30.25 11.76,30.49 R3.1 9.7,30.49 9.38,30.81 J_PRG.2 | 8.37,14.68 U10.1 9.37,14.31 9.85,13.82 C34.1 10.9,12.93 11.28,12.55 | 21.44,11.75 U9.P$1 21.46,12.39 | 21.44,11.75 21.13,11.44 U9.P$16 | U6.14 44.75,10.83 44.94,10.65 | U6.19 44.69,8.33 44.94,8.58 | 44.94,8.58 44.94,10.65 | U6.32 48.7,4.18 48.75,4.14 48.75,3.19 48.11,2.55 46.37,2.55 45.7,3.21 U6.26 45.7,5.7 v45.73,5.73 | 44.94,8.58 45.26,8.58 v45.41,8.43 | AMPLIFIER.11 AMPLIFIER.12 | 21.44,11.75 21.69,11.5 C32.1 23.19,12.24 v23.51,12.55 23.51,13.66 23.82,13.98 24.94,13.98 25.25,14.3 R26.2 R25.2 | R25.2 25.25,18.27 24.78,18.74 22.08,18.74 21.6,19.22 21.6,20.49 C2.2 21.6,23.11 v21.52,23.19 20.97,23.19 20.85,23.07 U1.34 | 44.94,10.65 v45.33,11.04 | v48.19,11.6 U6.6 48.19,12.8 48.19,13.43 47.95,13.66 47.95,14.3 48.03,14.38 v48.03,17.87 | MICROSD.4 34,36.06 v33.98,36.05 | v42.4,29.7 42.4,25.89 | 42.4,25.89 v42.4,25.41 | 11.28,12.55 v14.46,12.55 14.93,12.08 14.93,7.95 13.76,6.77 C33.1 12.73,6.75 U11.P$3 12.73,4.44 13.03,4.14 U11.P$2 | v20.65,28.43 20.65,28.27 20.45,28.07 U1.44 | R16.2 33.19,12.24 32.24,13.19 v32.24,14.14 | R22.2 66.21,22.71 | R25.2 27.79,17.32 EXT.2 | 11.28,12.55 10.81,12.08 C42.2 9.54,10.97 9.99,10.51 IO1.8 | R6.1 42.4,25.89 | 42.4,25.89 43.41,25.89 C23.1
  Top 0.254: 65.73,14.54 65.73,14.59 AMPLIFIER.12
  Top 0.305: 8.37,14.68 U10.14 | U9.P$16 | U7.1 50.63,26.52 C6.2 49.07,27 v49.07,25.25 | v34.94,24.46 33.59,23.11 FB1.1 32.7,21.82 32.48,21.6 32.48,15.41 32.24,15.17 v32.24,14.14 | U11.P$2
  Top 0.406: v67.32,14.5 67.28,14.54 65.73,14.54 | v67.32,17.95 C11.2 C10.2 66.21,21.92 66.21,22.71 66.21,23.35 64.78,24.78 49.54,24.78 v49.07,25.25
  Bottom 0.203: v45.41,8.43 45.41,7.31 45.73,7 v45.73,5.73 | v45.33,11.04 45.89,11.6 v48.19,11.6 | v48.03,17.87 47.64,18.27 47.64,25.25 | v33.98,36.05 34.78,36.05 34.94,35.89 39.86,35.89 42.4,33.35 v42.4,29.7 | v14.46,12.55 14.78,12.24 23.19,12.24 v23.51,12.55 | v20.65,28.43 20.17,27.95 20.17,23.55 20.53,23.19 v21.52,23.19 | v42.4,25.41 42.4,25.09
  Bottom 0.305: v34.94,24.46 35.57,25.09 42.4,25.09 46.05,25.09 46.21,25.25 47.64,25.25 v49.07,25.25 | EXT.2 30.25,17.32 30.73,16.84 30.73,14.62 31.21,14.14 v32.24,14.14
  Bottom 0.406: v67.32,17.95 v67.32,14.5
+UB
  Top 0.406: LIPO+.1 67.96,31.13 66.05,33.03 64.15,33.03 Q2.2
AGND  (via drill 0.3 pad 0.61)
  Top 0.203: AMPLIFIER.8 65.62,12.6 65.26,12.24 v64.62,12.24 | AMPLIFIER.1 62.67,16.08 62.96,16.36 v63.67,16.36 | U6.47 51.32,10.83 51.13,10.65 51.13,8.11 51.4,7.83 | U6.37 51.34,5.83 51.13,6.04 51.13,7.56 51.4,7.83 | v53.35,8.27 53.24,7.83 U6.41 51.4,7.83
  Top 0.305: R32.1 v35.73,16.68 35.25,16.68 34.78,16.2 33.51,16.2 | 33.51,16.2 C22.1 | 33.51,16.2 33.51,14.99 FB2.2
  other vias: 44.78,22.24 64.15,13.51 64.15,14.3 64.15,15.09 63.67,12.24 64.62,16.36 63.04,21.28 67.48,19.22 53.35,22.24 59.23,16.68 48.43,20.97 53.03,12.39 41.13,20.33 45.1,19.22 41.13,16.2 44.78,16.2 35.41,20.65 38.11,23.51 60.18,23.51 54.94,17.16 53.35,7.47
  pour Top: 52.24,0.17 52.24,4.3 51.45,5.09 51.45,13.98 49.07,13.98 49.07,15.89 35.57,15.89 34.94,16.52 34.94,23.19 35.57,23.82 65.1,23.82 68.91,20.01 68.91,18.59 67,16.68 66.21,16.68 65.73,16.2 65.73,12.39 66.05,12.08 66.53,12.08 67.96,10.65 67.96,9.85 68.59,9.22 70.81,9.22 72.72,7.31 72.72,4.14 72.56,2.87 71.61,1.44 70.5,0.49 68.91,0.17
  pour Bottom: 35.57,23.82 65.1,23.82 69.23,19.7 70.81,19.7 70.81,9.22 72.72,7.31 72.72,4.14 72.56,2.87 71.61,1.44 70.5,0.49 68.91,0.17 52.24,0.17 52.24,4.3 51.45,5.09 51.45,13.98 49.07,13.98 49.07,15.89 35.57,15.89 34.94,16.52 34.94,23.19
AINL+
  Top 0.203: AMPLIFIER.3 62,14.7 61.29,15.41 61.29,16.2 62.4,17.32 C12.1
AINL-
  Top 0.203: AMPLIFIER.4 61.77,14.3 61.13,14.93 C13.1
AINR+
  Top 0.203: AMPLIFIER.7 61.99,13.1 61.29,12.39 C14.1
AINR-
  Top 0.203: C15.1 61.13,12.87 61.77,13.51 AMPLIFIER.6
AREF
  Top 0.203: U1.42 20.4,27.07 20.97,27.63 C4.1
AVDD  (via drill 0.3 pad 0.61)
  Top 0.203: U6.45 53.05,9.83 53.19,9.7 v53.19,9.38 53.19,8.98 53.03,8.82 52.17,8.82 U6.43 | U6.38 53.01,6.33 v53.19,6.2
  Top 0.305: 37.79,18.9 R29.2 36.37,18.74 36.21,18.9 v34.78,18.9 33.59,18.9 | C22.2 33.59,18.9 | 33.59,18.9 FB1.2
  Bottom 0.203: v34.78,18.9 34.78,16.05 35.25,15.57 47.32,15.57 47.95,14.93 47.95,13.66 48.43,13.19 50.02,13.19 50.49,12.71 50.49,10.33 50.97,9.85 52.08,9.85 52.56,9.38 | 52.56,9.38 v53.19,9.38 | v53.19,6.2 52.56,6.84 52.56,9.38
CHG  (via drill 0.3 pad 0.61)
  Top 0.203: v29.06,29.22 29.54,28.75 35.89,28.75 38.75,31.6 45.1,31.6 47.16,33.67 47.63,33.67 R9.1 v48.59,31.92 | IC2.3 56.37,37.48 56.84,37 56.84,33.19 55.89,32.24 v55.89,30.65 57.8,30.65 58.59,29.86 D2.2 | U1.21 12.38,23.57 v12.31,23.51
  Bottom 0.203: v29.06,29.22 28.43,29.86 27.79,29.86 27.63,29.7 26.68,29.7 26.36,30.02 16.84,30.02 12.39,25.57 12.39,23.98 12.31,23.9 v12.31,23.51 | v48.59,31.92 49.86,30.65 v55.89,30.65
CS  (via drill 0.3 pad 0.61)
  Top 0.203: 42.72,5.41 v42.72,5.25 42.72,6.2 42.85,6.33 U6.23 | U1.8 15.52,30.7 v13.66,32.56 | v32.24,8.11 31.92,8.43 31.92,11.6 31.13,12.39 31.13,15.41 31.52,15.81 31.52,23.59 32.08,24.14 v32.08,24.94
  Bottom 0.203: v42.72,5.25 42.08,5.25 41.76,5.57 33.51,5.57 32.24,6.84 v32.24,8.11 | v13.66,32.56 13.98,32.87 30.81,32.87 32.56,31.13 32.56,25.41 v32.08,24.94
D+
  Top 0.203: USB.P3 20.33,36.05 19.7,35.41 R1.2
D-
  Top 0.203: 20.97,36.69 USB.P2 20.98,35.87 21.76,35.1 R2.2
DREQ  (via drill 0.3 pad 0.61)
  Top 0.203: U6.8 47.2,14.57 v47.16,14.62 | U1.20 12.08,24.07 11.76,23.74 11.76,21.92 13.35,20.33 v13.51,20.33
  Bottom 0.203: v47.16,14.62 34.62,14.62 33.98,15.25 33.98,20.97 32.87,22.08 24.14,22.08 22.55,20.49 15.73,20.49 15.57,20.65 14.93,20.65 14.62,20.33 v13.51,20.33
GAIN  (via drill 0.3 pad 0.61)
  Top 0.203: AMPLIFIER.5 61.77,13.9 v61.13,13.9 | v60.34,17.95 60.34,18.74 59.07,20.01 v58.43,20.01 | U1.12 13.12,28.36 v13.35,28.59 | v29.54,25.25 29.86,25.57 34.78,25.57 v34.94,25.73
  Bottom 0.203: v34.94,25.73 36.37,25.73 37.32,26.68 50.97,26.68 53.35,24.3 55.57,24.3 57.96,21.92 57.8,20.65 v58.43,20.01 | J_GAIN.2 v61.13,13.9 61.13,17.16 v60.34,17.95 | v13.35,28.59 13.82,28.59 16.2,30.97 28.9,30.97 29.86,30.02 29.86,26.05 29.54,25.73 v29.54,25.25
GND  (via drill 0.3 pad 0.61)
  Top 0.203: U1.5 17,28.97 | U1.43 19.32,27.57 | 19.32,27.57 19.06,27.32 19.06,23.82 19.32,23.57 U1.35 | 49.22,12.76 49.22,12.71 | 49.22,12.71 49.22,9.85 v49.54,9.54 | U6.35 50.2,6.49 v49.54,7.16 | U6.20 45.13,7.83 45.49,7.47 v46.68,7.47 | U6.16 43.05,9.83 42.72,10.17 42.72,10.81 | R8.2 | 11.44,29.22 11.52,29.14 11.52,27.4 12.31,26.6 13.09,26.6 U1.15 13.78,26.57 | U1.5 17.02,30.2 18.43,31.6 18.43,35.57 v18.27,35.73 | T1.E 65.88,28.44 65.73,28.59 65.73,29.22 65.42,29.54 61.61,29.54 R28.2 | U9.P$8 18.56,16.23 18.11,16.68 | 18.59,17.63 18.9,17.95 21.44,17.95 v21.6,17.79 | U6.4 49.2,12.73 49.22,12.71 | U1.5 17.02,28.25 17.16,28.11 18.78,28.11 19.32,27.57 | 13.98,18.9 13.98,19.86 14.14,20.01 14.14,20.97 14.02,21.09 U1.23 | 13.98,22.08 13.98,23.03 | 43.75,7.31 44.86,7.31 | U6.22 44.86,6.84 | 18.59,28.11 19.06,28.11 19.7,28.75 19.86,28.75 | 18.9,23.03 19.06,23.03 19.54,22.55 19.86,22.55 | 24.78,39.38 24.78,40.33 24.94,40.49 25.09,40.49 25.25,40.65 MICROSD.MT2
  Top 0.305: U6.22 U6.21 U6.20
  Top 0.406: MICROSD.6 36.2,38.1 36.21,38.11 39.06,38.11 39.06,38.27 39.38,38.59 39.38,39.66 MICROSD.MT1
  Top 0.813: 21.44,39.38 24.78,39.38
  other vias: 46.53,9.38 22.24,16.28 58.59,36.21 64.94,34.62 43.51,30.33 35.89,13.19 36.05,10.49 51.76,27.63 45.26,27.48 35.73,30.49 28.43,38.59 10.49,20.33 26.05,28.27 33.35,26.84 66.69,26.36 63.19,29.38 12,17.95 27,24.94 22.24,1.44 24.78,8.9 9.85,29.06 2.87,33.03 50.49,31.76 13.98,15.41 7.63,23.19 7.63,29.22 40.18,30.17 54.46,32.08 58.43,33.35 59.86,28.43 50.1,25.57 53.51,37.48 53.51,35.57 53.51,36.52 57,39.86 22.24,4.3 24.3,5.89 9.06,13.35 20.97,22.4 33.83,31.76 31.92,32.71 10.97,34.94 25.89,34.14 29.22,24.46 27,26.52 11.44,16.36 45.26,25.89 39.54,25.89 53.59,25.57 29.06,27 34.46,35.25 35.89,32.71 37.56,28.11 44.3,32.71 45.1,34.94 55.97,36.52 33.03,24.86 32.71,23.19 28.59,34.94 23.19,28.9 13.19,21.76 16.05,9.7 16.68,15.57 10.01,6.68 13.51,10.65 14.14,13.35 13.35,11.92 27.16,5.73 14.93,1.76 14.93,4.3 26.68,1.28
  pour Top: 0.17,37.48 0.17,4.3 0.33,2.71 1.28,1.28 2.39,0.49 4.46,0.17 50.97,0.17 50.97,3.66 50.18,4.46 50.18,12.71 50.89,13.43 47.95,13.35 47.95,14.93 34.78,14.93 33.98,15.73 33.98,23.82 34.94,24.78 65.42,24.78 69.23,20.97 70.97,20.97 70.97,32.24 73.04,34.3 73.04,38.11 72.72,39.22 72.08,40.33 70.81,41.29 69.23,41.76 3.98,41.76 2.39,41.45 1.28,40.65 0.49,39.54
  pour Bottom: 0.17,37.48 0.49,39.54 1.28,40.65 2.39,41.45 3.98,41.76 69.23,41.76 70.81,41.29 72.08,40.33 72.72,39.22 73.04,38.11 73.04,34.3 70.97,32.24 70.97,20.97 69.23,20.97 65.42,24.78 34.94,24.78 33.98,23.82 33.98,15.73 34.78,14.93 47.95,14.93 47.95,13.35 50.18,13.35 50.18,4.46 50.97,3.66 50.97,0.17 4.46,0.17 2.39,0.49 1.28,1.28 0.33,2.71 0.17,4.3
GPIO0
  Top 0.203: 49.22,4.06 U6.33 49.2,2.85 48.43,2.08 46.05,2.08 44.7,3.43 R34.3
GPIO1
  Top 0.203: R34.2 44.7,2.63 45.73,1.6 48.91,1.6 49.7,2.4 U6.34
GPIO2
  Top 0.203: 46.68,13.19 U6.9 46.68,12.8 46.68,14.14 46.21,14.62 40.18,14.62 39.81,14.25 R21.4
GPIO3
  Top 0.203: U6.10 46.21,12.87 46.21,13.82 45.89,14.14 40.49,14.14 39.7,13.35 38.73,13.35 R21.3
GPIO4
  Top 0.203: U6.36 50.73,4.22 50.73,2.47 49.35,1.09 45.44,1.09 44.81,1.73 R34.1
GPIO5
  Top 0.203: R34.4 45.15,4.33 U6.25
GPIO6
  Top 0.203: 45.73,13.11 U6.11 45.73,12.81 45.73,13.51 45.57,13.66 40.81,13.66 39.7,12.55 R21.2
GPIO7
  Top 0.203: U6.12 44.87,12.78 44.46,13.19 41.13,13.19 39.59,11.65 R21.1
GYR  (via drill 0.3 pad 0.61)
  Top 0.203: v15.89,18.59 15.89,19.06 17.02,20.2 U1.29
  Bottom 0.203: v15.89,18.59 16.52,17.95 19.06,17.95 19.54,17.47 J_GYR.2 17.95,15.57
GYR_INT  (via drill 0.3 pad 0.61)
  Top 0.203: U9.P$7 19.21,16.69 v18.9,17
  Bottom 0.203: J_GYR.1 18.01,16.58 18.43,17 v18.9,17
GYR_RDY  (via drill 0.3 pad 0.61)
  Top 0.203: U9.P$6 19.86,16.69 20.17,17 v20.65,17
  Bottom 0.203: J_GYR.3 21.06,16.58 v20.65,17
L_OUT
  Top 0.203: C28.- 60.32,22.57 62.4,20.49 C12.2
LED  (via drill 0.3 pad 0.61)
  Top 0.203: U1.31 18.02,19.93 17,18.9 17,17.95 v16.36,17.32 | v12.08,19.38 12.08,19.7 9.54,22.24 6.04,22.24 5.57,22.71 5.57,27.95 5.09,28.43 3.82,28.43 3.03,29.22 3.03,31.76 3.66,32.4 v5.89,32.4 | R5.1 14.78,36.05 14.3,36.05 14.14,36.21 12.39,36.21 12.08,35.89 v12.08,35.41
  Bottom 0.203: v5.89,32.4 10.81,32.4 12.08,33.67 v12.08,35.41 | v12.08,19.38 13.66,19.38 14.14,18.9 14.78,18.9 v16.36,17.32
LED_STRIP  (via drill 0.3 pad 0.61)
  Top 0.203: v28.11,29.22 29.38,30.49 31.29,30.49 33.51,32.71 v33.51,35.25 | U1.27 16.02,21.26 v15.89,21.13
  Bottom 0.203: STRIP.2 45.1,37.64 44.78,37.32 33.67,37.32 33.35,37 33.35,35.41 v33.51,35.25 | v28.11,29.22 26.52,29.22 26.21,29.54 20.81,29.54 19.86,28.59 17,28.59 14.46,26.05 14.46,22.55 v15.89,21.13
LEFT
  Top 0.203: U6.46 53.04,10.33 53.67,10.97 R17.2 R19.2
LEFT_FILTERED
  Top 0.203: R19.1 55.57,16.52 56.84,17.79 57.94,17.79 C28.+
LINE+
  Bottom 0.203: J_AIN.3 51.76,10.49 51.92,10.33 LINE+.1
LINE-  (via drill 0.3 pad 0.61)
  Top 0.203: U6.48 52.93,11.33 v53.03,11.44
  Bottom 0.203: v53.03,11.44 56.05,11.44 LINE-.1
LSM  (via drill 0.3 pad 0.61)
  Top 0.203: U1.28 16.52,20.33 14.62,18.43 v14.62,17.95
  Bottom 0.203: v14.62,17.95 14.3,17.95 13.66,18.59 11.28,18.59 10.49,19.38 8.58,19.38 8.27,19.06 J_LSM.2
LSM_DRDY  (via drill 0.3 pad 0.61)
  Top 0.305: U10.9 5.96,17.88 v5.89,17.95
  Bottom 0.203: 6.68,17.95 8.11,17.95
  Bottom 0.305: v5.89,17.95 6.68,17.95 J_LSM.3
LSM_INT1  (via drill 0.3 pad 0.61)
  Top 0.203: U10.5 10.26,17.88 10.49,18.11 10.49,18.74 v11.28,19.54 | v19.54,29.38 19.43,29.38 U1.1
  Bottom 0.203: v11.28,19.54 12.71,20.97 13.51,20.97 13.98,21.44 13.98,26.36 17,29.38 v19.54,29.38
LSM_INT2  (via drill 0.3 pad 0.61)
  Top 0.203: U10.4 10.41,17.08 v10.97,17.63
  Bottom 0.203: v10.97,17.63 10.65,17.95 J_LSM.1
M+
  Top 0.203: C24.1 C38.2 51.13,20.49 50.81,20.81 50.81,21.65 MIC.+ 50.81,21.72 50.81,22.4 50.49,22.71 48.91,22.71 48.59,22.71 R30.2
M-
  Top 0.203: C25.1 C38.1 | C38.1 49.23,20.49 49.54,20.81 49.54,21.65 MIC.- | R31.1 48.03,18.82 48.11,18.9 C38.1
MIC+  (via drill 0.3 pad 0.61)
  Top 0.203: C24.2 v52.24,15.1 v52.24,15.09
  Bottom 0.203: v52.24,15.09 52.24,14.71 J_AIN.1
MIC-
  Top 0.203: C25.2 49.22,14.14 49.54,13.82 49.86,13.82 50.2,13.48 U6.2
MISO  (via drill 0.3 pad 0.61)
  Top 0.203: v30.81,24.94 30.81,24.14 30.57,23.9 30.57,16.12 30.17,15.73 30.17,12.08 30.97,11.28 30.97,7.47 31.44,7 31.44,3.66 v32.08,3.03 | U6.30 47.7,3.28 v47.8,3.19 | v31.29,29.38 33.51,29.38 37.3,33.17 MICROSD.7 | v3.03,22.24 3.03,28.43 ISP6.1 | U1.11 14.02,29.5 13.82,29.7 v13.51,29.7
  Bottom 0.203: v47.8,3.19 47.16,2.55 46.37,2.55 45.89,3.03 v32.08,3.03 | v30.81,24.94 30.81,25.41 31.29,25.89 v31.29,29.38 31.29,30.17 29.54,31.92 14.62,31.92 13.19,30.49 13.19,30.02 | v3.03,22.24 3.66,21.6 9.38,21.6 10.65,22.87 10.65,27.95 12.71,30.02 13.19,30.02 | 13.19,30.02 v13.51,29.7
MOSI  (via drill 0.3 pad 0.61)
  Top 0.203: v31.44,24.46 31.29,24.3 31.29,23.98 31.05,23.74 31.05,15.97 30.65,15.57 30.65,12.24 31.44,11.44 31.44,7.71 31.92,7.23 31.92,4.3 v32.4,3.82 | U6.29 47.2,3.71 v46.68,3.19 | MICROSD.3 32.9,32.74 32.24,32.08 v30.49,32.08 | U1.10 14.52,29.79 v13.03,31.29
  Bottom 0.203: v32.4,3.82 32.71,3.5 46.37,3.5 v46.68,3.19 | v31.44,24.46 31.44,25.25 31.92,25.73 31.92,30.65 v30.49,32.08 30.17,32.4 14.46,32.4 13.82,31.76 13.51,31.76 v13.03,31.29 10.17,28.43 10.17,23.19 9.22,22.24 4.3,22.24 3.03,23.51 3.03,25.89 ISP6.4
N$1
  Top 0.203: Y1.1 6.48,26.72 6.84,26.36 8.9,26.36 9.22,26.68 10.16,26.68 C9.1 10.82,26.67 11.44,26.05 13.1,26.05 U1.16
N$2
  Top 0.203: U1.4 17.52,30.06 19.7,32.24 R1.1
N$3  (via drill 0.3 pad 0.61)
  Top 0.203: v28.43,27.79 28.9,28.27 36.13,28.27 38.98,31.13 45.41,31.13 46.84,32.56 v47.32,32.56 | v25.89,24.62 R13.2
  Top 0.406: v50.97,39.06 C16.2 52.21,39.03 IC2.4
  Bottom 0.203: v47.32,32.56 49.38,32.56 50.02,33.19 50.02,38.75 50.34,39.06 v50.97,39.06 | v28.43,27.79 27.32,27.79 25.89,26.36 v25.89,24.62
  Bottom 0.406: CHG+.1 67.96,23.51 65.1,26.36 65.1,31.44 57.48,39.06 v50.97,39.06
N$4
  Top 0.203: U1.17 11.44,25.57 10.97,25.09 10.66,25.09 C8.1 10.65,25.09 9.7,25.09 9.55,24.95 9.55,24.79 9.54,24.94 9.54,24.48 Y1.3
N$5
  Top 0.203: C1.1 17.32,31.13 16.52,30.33 U1.6
N$6
  Top 0.406: STRIP.1 42.08,39.38 41.29,38.59 C39.2 C40.2 43.6,36.84 FB3.1
N$7
  Top 0.203: U1.3 18.02,29.93 19.54,31.44 20.65,31.44 21.13,31.92 21.6,31.92 21.76,32.08 R2.1
N$8
  Top 0.203: D3.A R5.2
N$9
  Top 0.203: 64.77,28.43 T1.B 64.63,27.63 64.78,27.48 65.1,27.48 65.42,27.16 R4.1
N$10
  Top 0.203: 65.56,30.81 T1.C 63.83,30.65 63.67,30.81 D2.3 61.77,30.82 61.77,31.6 62.31,32.14 Q2.1
  Top 0.406: T1.C 65.58,30.81 | Q2.1 60.09,32.97 R10.1
N$11
  Top 0.203: R4.2 63.51,26.05 R28.1 61.61,26.21 60.81,26.21 60.34,26.68 D1.3
N$12
  Top 0.203: D1.2 56.53,25.73 56.21,26.05 WUP.1
N$13
  Top 0.203: T2.B R24.2
N$14
  Top 0.305: 17.01,1.6 T2.C 18.43,1.28 18.74,1.6 VIB-.1
N$15  (via drill 0.3 pad 0.61)
  Top 0.203: U1.40 20.99,26.07 21.28,26.36 ADC1.TP
  other vias: 22.4,26.36
N$16  (via drill 0.3 pad 0.61)
  Top 0.203: U6.1 51.06,12.78 v51.13,12.95
  Bottom 0.203: v51.13,12.95 J_AIN.2 51.76,14.3
N$17
  Top 0.254: 68.59,16.68 68.59,17.08 | AMPLIFIER.14 65.62,15.62 65.65,15.65
  Top 0.559: 65.65,15.65 65.97,15.65 66.05,15.73 67.4,15.73 67.72,16.05
  Top 0.813: 68.59,17.08 OUTL-.1
  pour Top (isolate 0.254): 65.5,15.57 65.58,15.57 65.81,15.81 66.69,15.81 68.91,18.03 69.07,18.03 69.46,17.63 69.46,17.39 67.56,15.49 65.5,15.41
N$18  (via drill 0.3 pad 0.61)
  Top 0.203: v61.92,22.71 R22.1
  Bottom 0.203: J_GAIN.1 59.94,16.92 59.7,17.16 59.7,18.43 60.5,19.22 60.5,21.28 v61.92,22.71
N$19
  Top 0.254: AMPLIFIER.13 68.12,15.09 68.35,15.33
  Top 0.813: OUTL+.1 68.59,15.57 68.35,15.33
  pour Top (isolate 0.254): 65.5,15.17 66.13,15.17 66.21,15.25 67.64,15.25 68.35,15.97 68.59,15.97 69.07,16.44 69.86,16.44 70.34,15.97 70.34,15.09 69.94,14.7 68.59,14.7 68.35,14.93 66.61,14.93 66.53,15.01 65.5,15.01
N$20
  Top 0.203: R32.2 40.65,16.68 40.81,16.84 43.02,16.84 C37.- 46.77,16.85 R31.2
N$21  (via drill 0.3 pad 0.61)
  Top 0.203: U1.41 20.7,26.57 v20.97,26.84
  Bottom 0.203: v20.97,26.84 21.44,26.84 ADC0.TP
N$22
  Top 0.203: IO1.2 5.1,9.86 4.3,9.06 2.55,9.06 Q6.1 C44.1
N$23
  Top 0.203: R29.1 39.38,20.49 40.18,21.28 40.18,22.7 C26.+ 42.87,22.55 43.03,22.4 C37.+ 44.63,20.95 44.78,20.81 R30.1
N$24
  Top 0.254: AMPLIFIER.10 67.4,13.9 68.27,13.03
  Top 1.016: OUTR+.1 68.83,13.03 68.35,13.51
  pour Top (isolate 0.254): 66.21,13.98 70.02,13.98 70.42,13.58 70.42,12.55 69.94,12.08 69.15,12.08 68.59,12.63 68.51,12.63 68.19,12.95 67.88,12.95 67.08,13.74 66.37,13.74 66.37,13.82
N$25
  Top 0.254: AMPLIFIER.9 66.22,13.5 66.29,13.51 66.77,13.51 67.72,12.55 67.96,12.08
  Top 0.813: 67.96,12.08 OUTR-.1
  pour Top (isolate 0.254): 65.42,13.58 66.77,13.58 67.64,12.71 67.88,12.71 69.31,11.28 69.07,11.12 68.99,11.04 68.75,11.04 68.59,10.89 66.05,13.43 65.42,13.43
N$26  (via drill 0.3 pad 0.61)
  Top 0.203: v63.04,10.97 63.04,10.33 63.51,9.85 R23.2
  Bottom 0.203: v63.04,10.97 61.61,12.39 59.96,12.39 J_GAIN.3
N$27
  Top 0.203: IO1.1 5.11,10.51 4.93,10.33 Q6.2 3.82,11.28 3.66,11.44 C43.1
N$29
  Top 0.203: U6.17 42.92,9.33 42.4,9.85 41.67,9.85 C19.1 41.54,9.85 40.81,9.85 40.33,10.33 38.11,10.33 37.79,10.01 Y2.1 37.64,8.74 R15.2
  Top 0.305: 37.7,8.81 Y2.1
N$30
  Top 0.203: U6.18 42.81,8.83 42.4,8.43 41.7,8.43 C18.1 40.71,8.33 40.49,8.11 40.49,6.84 40.33,6.68 40.32,6.69 Y2.2 39.38,5.73 39.22,5.57 36.21,5.57 35.89,5.89 R15.1
  Top 0.305: 39.4,6.68 Y2.2
N$31
  Top 0.203: R17.1 53.67,16.36 53.35,16.68 C20.2
N$32
  Top 0.203: 54.62,4.14 C21.2
  Top 0.406: 54.62,4.14 R18.1
N$37  (via drill 0.3 pad 0.61)
  Top 0.203: IO1.3 v5.58,9.21 v5.57,9.22
  Bottom 0.203: v5.57,9.22 5.57,11.12 1.76,14.93 BAT+.1
N$40
  Top 0.203: U9.P$5 20.51,15.91 20.81,16.2 21.13,16.2 22.24,17.32 R25.1
N$41
  Top 0.203: R26.1 22.08,15.25 21.44,14.61 U9.P$4
N$42
  Top 0.203: C31.1 R27.2
N$43
  Top 0.203: U9.P$14 19.21,9.78 | C31.2 17.09,8.36 17.32,8.58 18.9,8.58 19.12,8.81 C30.2
  Top 0.305: 19.21,9.78 C30.2
N$44
  Top 0.203: C35.1 9.22,20.33 9.38,20.17 U10.6
N$45
  Top 0.203: 5.16,16.2 5.09,16.14 C36.1 5.79,15.73 6.2,15.73 6.45,15.48 U10.12
N$46
  Top 0.203: 5.16,14.14 C36.2 5.47,13.66 6.2,13.66 6.36,13.82 6.36,14.3 6.74,14.68 U10.13
PWR_CMD  (via drill 0.3 pad 0.61)
  Top 0.203: v19.86,18.59 v19.86,21.76 | v57.32,28.9 57.32,27.64 D1.1 | U1.25 15.02,21.69 14.62,21.28 v14.62,19.54
  Bottom 0.203: v57.32,28.9 37.16,28.9 34.3,26.05 34.3,23.51 33.35,22.55 22.71,22.55 21.92,21.76 v19.86,21.76 | v19.86,18.59 18.74,18.59 18.59,18.43 17.16,18.43 16.2,19.38 14.78,19.38 v14.62,19.54
R_OUT
  Top 0.203: C14.2 61.29,8.58 62.88,7 62.88,5.75 C29.-
RESET  (via drill 0.3 pad 0.61)
  Top 0.203: U1.13 12.62,27.57 12.39,27.79 12.39,29.06 12.55,29.22 | 12.07,32.39 12.08,32.4 12.08,32.56 13.51,33.98 RST.3 | R3.2 12.07,32.39 | 12.07,32.39 12.08,32.39 12.08,30.81 12.39,30.49 12.39,29.38 12.55,29.22 | 12.55,29.22 v12.87,29.22
  Bottom 0.203: ISP6.5 1.76,22.08 2.71,21.13 9.7,21.13 11.12,22.55 11.12,27.48 v12.87,29.22
RIGHT
  Top 0.203: U6.39 53.03,6.83 53.19,6.84 54.62,6.83 R18.2 54.62,6.84 R20.2
RIGHT_FILTERED
  Top 0.203: R20.1 57.48,8.27 58.11,7.63 58.11,5.75 C29.+
RST  (via drill 0.3 pad 0.61)
  Top 0.203: U6.3 49.7,11.6 v49.86,11.44 | R16.1 v33.19,8.11 C27.2 | U1.32 18.52,19.47 v18.11,19.06
  Bottom 0.203: v49.86,11.44 49.16,10.69 | 49.16,10.69 48.83,10.33 | v18.11,19.06 19.22,19.06 19.38,19.22 25.57,19.22 26.21,18.59 32.4,18.59 33.03,17.95 33.03,13.82 35.25,11.6 | 35.25,11.6 41.6,11.6 42.87,10.33 48.8,10.33 49.16,10.69 | v33.19,8.11 33.19,9.54 35.25,11.6
SCL  (via drill 0.3 pad 0.61)
  Top 0.203: U1.18 11.66,25.07 10.97,24.38 10.97,21.44 12.71,19.7 12.71,16.36 v11.76,15.41 10.65,15.41 10.58,15.48 U10.2 | U9.P$2 22.56,13.02 v22.71,12.87 | U11.P$5 9.53,3.83 9.06,4.3 9.06,8.9 9.38,9.22 IO1.6 v11.6,9.22
  Bottom 0.203: EXT.5 26.05,9.7 25.41,10.33 25.41,11.76 23.98,13.19 23.03,13.19 v22.71,12.87 15.57,12.87 13.03,15.41 v11.76,15.41 11.76,9.85 11.6,9.7 v11.6,9.22
SCLK  (via drill 0.3 pad 0.61)
  Top 0.203: U6.28 46.7,5.43 v47,5.73 | v30.49,7 30.49,11.12 29.7,11.92 29.7,15.89 30.09,16.28 30.09,24.06 30.17,24.14 v30.17,24.46 | MICROSD.5 35.1,33.83 35.1,31.76 33.35,30.02 30.81,30.02 30.49,29.7 v30.49,29.38 | U1.9 15.02,30.25 v14.78,30.49 13.03,32.24 v12.71,32.24
  Bottom 0.203: v47,5.73 45.26,3.98 33.51,3.98 v30.49,7 | v30.17,24.46 30.17,25.57 30.49,25.89 v30.49,29.38 30.49,30.17 29.22,31.44 15.73,31.44 v14.78,30.49 | v12.71,32.24 12.39,32.24 11.28,31.13 3.82,31.13 3.03,30.33 3.03,28.43 ISP6.3
SD_DETECT
  Top 0.203: R6.2 40.01,27.79 38.91,26.68 37.74,26.68 MICROSD.CD1 | U1.39 21.13,25.57 21.44,25.89 22.08,25.89 22.24,25.73 28.9,25.73 29.22,26.05 30.17,26.05 30.49,26.36 30.49,27.48 30.81,27.79 34.3,27.79 35.45,26.65 35.85,26.65 35.89,26.68
  Top 1.422: 35.89,26.68 37.66,26.68 MICROSD.CD1
SDA  (via drill 0.3 pad 0.61)
  Top 0.203: U10.3 v10.41,16.28 | U1.19 11.95,24.57 11.36,23.98 11.36,21.68 13.35,19.7 v13.35,17 | U9.P$3 22.55,13.67 v22.71,13.82 | U11.P$6 9.83,1.9 11.12,3.19 11.12,7 10.65,7.47 v10.65,7.95 10.65,8.55 IO1.5
  Bottom 0.203: EXT.4 25.73,12.24 24.14,13.82 v22.71,13.82 16.52,13.82 v13.35,17 11.12,17 v10.41,16.28 10.41,8.66 10.65,8.43 v10.65,7.95
SDCS  (via drill 0.3 pad 0.61)
  Top 0.203: MICROSD.2 31.8,34.66 31.44,34.3 27.63,34.3 27,33.67 v27,30.33 | v12.39,22.55 12.71,22.55 13.03,22.87 13.03,23.03 13.07,23.07 U1.22
  Bottom 0.203: v27,30.33 26.84,30.49 16.52,30.49 11.6,25.57 11.6,23.35 v12.39,22.55
SHUTDOWN  (via drill 0.3 pad 0.61)
  Top 0.203: AMPLIFIER.2 62.24,15.1 61.92,15.41 v61.92,15.97 | v16.05,10.97 16.05,16.2 19.02,19.18 U1.33 | R33.2 59.23,1.28 v58.43,2.08
  Bottom 0.203: v61.92,15.97 61.92,13.03 63.99,10.97 63.99,7.63 v58.43,2.08 57.48,1.12 30.49,1.12 20.65,10.97 v16.05,10.97
TIMER  (via drill 0.3 pad 0.61)
  Top 0.203: IO1.7 11.77,9.86 12.24,10.33 12.24,10.97 v12.55,11.28 | v32,12.47 31.6,12.87 31.6,15.25 32,15.65 32,23.43 32.87,24.14 33.35,24.14 34.3,25.09 39.86,25.09 40.18,24.78 44.3,24.78 44.62,25.09 v44.62,29.54 | v58.43,31.76 D2.1
  Bottom 0.203: v12.55,11.28 15.25,11.28 15.57,11.6 20.81,11.6 25.09,7.31 28.9,7.31 32,10.41 v32,12.47 | v44.62,29.54 45.1,29.54 45.26,29.38 56.84,29.38 58.43,30.97 v58.43,31.76
V_CHG
  Top 0.203: U1.37 22.83,24.57 | 22.83,24.57 R13.1 | 22.83,24.57 22.83,22.76 R14.2
V_PWR  (via drill 0.3 pad 0.61)
  Top 0.203: R11.1 R12.2 | U1.36 20.64,24.07 v20.89,23.82 | v34.62,29.54 35.97,29.54 38.51,32.08 44.78,32.08 v47.32,34.62 | R12.2 | R12.2 59.62,39.86 v59.62,40.65
  Bottom 0.203: v20.89,23.82 32.87,23.82 33.83,24.78 33.83,26.21 34.62,27 v34.62,29.54 | v47.32,34.62 48.27,34.62 48.91,35.25 48.91,40.02 49.54,40.65 v59.62,40.65
V_VBUS  (via drill 0.3 pad 0.61)
  Top 0.203: R7.2 R8.1 24.94,30.17 25.09,30.02 v25.09,28.9 | U1.38 21.58,25.07 v21.76,25.25
  Bottom 0.203: v25.09,28.9 25.09,27.32 23.03,25.25 v21.76,25.25
VBUS  (via drill 0.3 pad 0.61)
  Top 0.203: U1.2 18.52,29.79 19.7,30.97 20.81,30.97 21.28,31.44 22.55,31.44 23.03,31.92 23.03,33.98 23.19,34.14 R7.1 24.14,35.57 | v25.89,35.57 24.14,35.57 | USB.P1 21.6,36.68 21.6,36.05 21.76,35.89 22.71,35.89 23.03,35.57 24.14,35.57 | v39.22,34.62 39.22,37 40.65,38.43 40.65,40.97 41.13,41.45 55.73,41.45 56.21,40.97 v56.21,38.27 | C17.2 55.57,33.98 v56.21,34.62 | IC2.1 54.81,35.28 54.46,34.94 C17.2 | U1.7 16.02,33.37 v15.89,33.51
  Top 0.406: C17.2
  Bottom 0.203: v39.22,34.62 30.02,34.62 29.06,35.57 v25.89,35.57 25.09,36.37 17.32,36.37 15.89,34.94 v15.89,33.51 | v56.21,34.62 56.69,35.1 56.69,37.79 v56.21,38.27
VCC  (via drill 0.3 pad 0.61)
  Top 0.203: R9.2 48.59,36.84 | v27.32,36.21 v27.32,34.94 | ISP6.2 5.41,30.81 J_PRG.1 7.03,32.75 v7.63,33.35
  Top 0.305: v28.11,24.46 29.54,23.03 29.54,16.52 29.06,16.05 27.95,16.05 27.63,15.73 EXT.3 27.63,13.82 27.32,13.51 26.21,13.51 25.73,13.03 25.73,8.9 26.36,8.27 C41.2 26.36,3.35 25.89,2.87 21.76,2.87 VIB+.1 | v27.79,33.51 27.79,30.17 27.32,29.7 27.32,27.95 v28.11,27
  Top 0.406: IC2.5 50.34,35.57 C3.2 v50.65,36.52 50.34,36.84 48.59,36.84 47.63,36.84 FB3.2 47.06,35.48 45.1,33.51 v40.18,33.51 | v58.75,34.94 59.07,35.25 R10.2 60.09,35 60.09,36.27 60.65,36.84 R11.2 61.61,37.96 61.92,38.27 61.92,39.38 62.24,39.7 STEPUP-.1 | U7.3 U7.4 | U7.5 U7.4 | U7.4 C5.2 52.72,31.76 v52.72,31.92 | Q2.3 63.19,35.57 63.51,35.89 STEPUP+.1
  Bottom 0.203: v7.63,33.35 11.28,37 26.52,37 v27.32,36.21 | v27.32,34.94 27.32,33.98 v27.79,33.51
  Bottom 0.305: v40.18,33.51 39.86,33.19 37.16,33.19 36.84,33.51 v27.79,33.51 | v28.11,27 v28.11,24.46
  Bottom 0.406: v58.75,34.94 57,33.19 52.72,33.19 | v50.65,36.52 52.72,34.46 52.72,33.19 | v52.72,31.92 52.72,33.19 | STEPUP+.1 STEPUP-.1
VIBRATOR
  Top 0.203: U1.30 17.52,20.06 16.52,19.06 16.52,18.27 15.41,17.16 15.41,7.16 15.89,6.68 15.89,5.89 R24.1
XDCS  (via drill 0.3 pad 0.61)
  Top 0.203: 43.83,11.92 v43.83,11.84 43.83,11.41 U6.13 | U1.26 15.52,21.55 15.25,21.28 v15.25,20.01
  Bottom 0.203: v15.25,20.01 22.71,20.01 24.3,21.6 32.56,21.6 33.51,20.65 33.51,14.14 35.57,12.08 43.59,12.08 v43.83,11.84

### Text on the board
tNames: LiPo | Charge | RTC / Backup | Audio out | Vibrating motor
bNames: OUT | StepUp In | Led strip | IN | For use : / 1. Cut the bridge / 2. Connect reg | WakeUp | + | WUP | LIPO | - | ISP | WUP | CHARGER | - | MurmureDuSon | (max 7V) | + | v2.0.x | GND | 3V3 | - | LEFT | DRDY | INT2 | 9dB | + | VCC | INT1 | RDY | MIC | SDA | 15dB | + | LINE | RIGHT | - | SCL | hugo, 05/2016 / www.digitalspirit.org